# Altium project CT9042.PrjPcb (part 1 of 2)
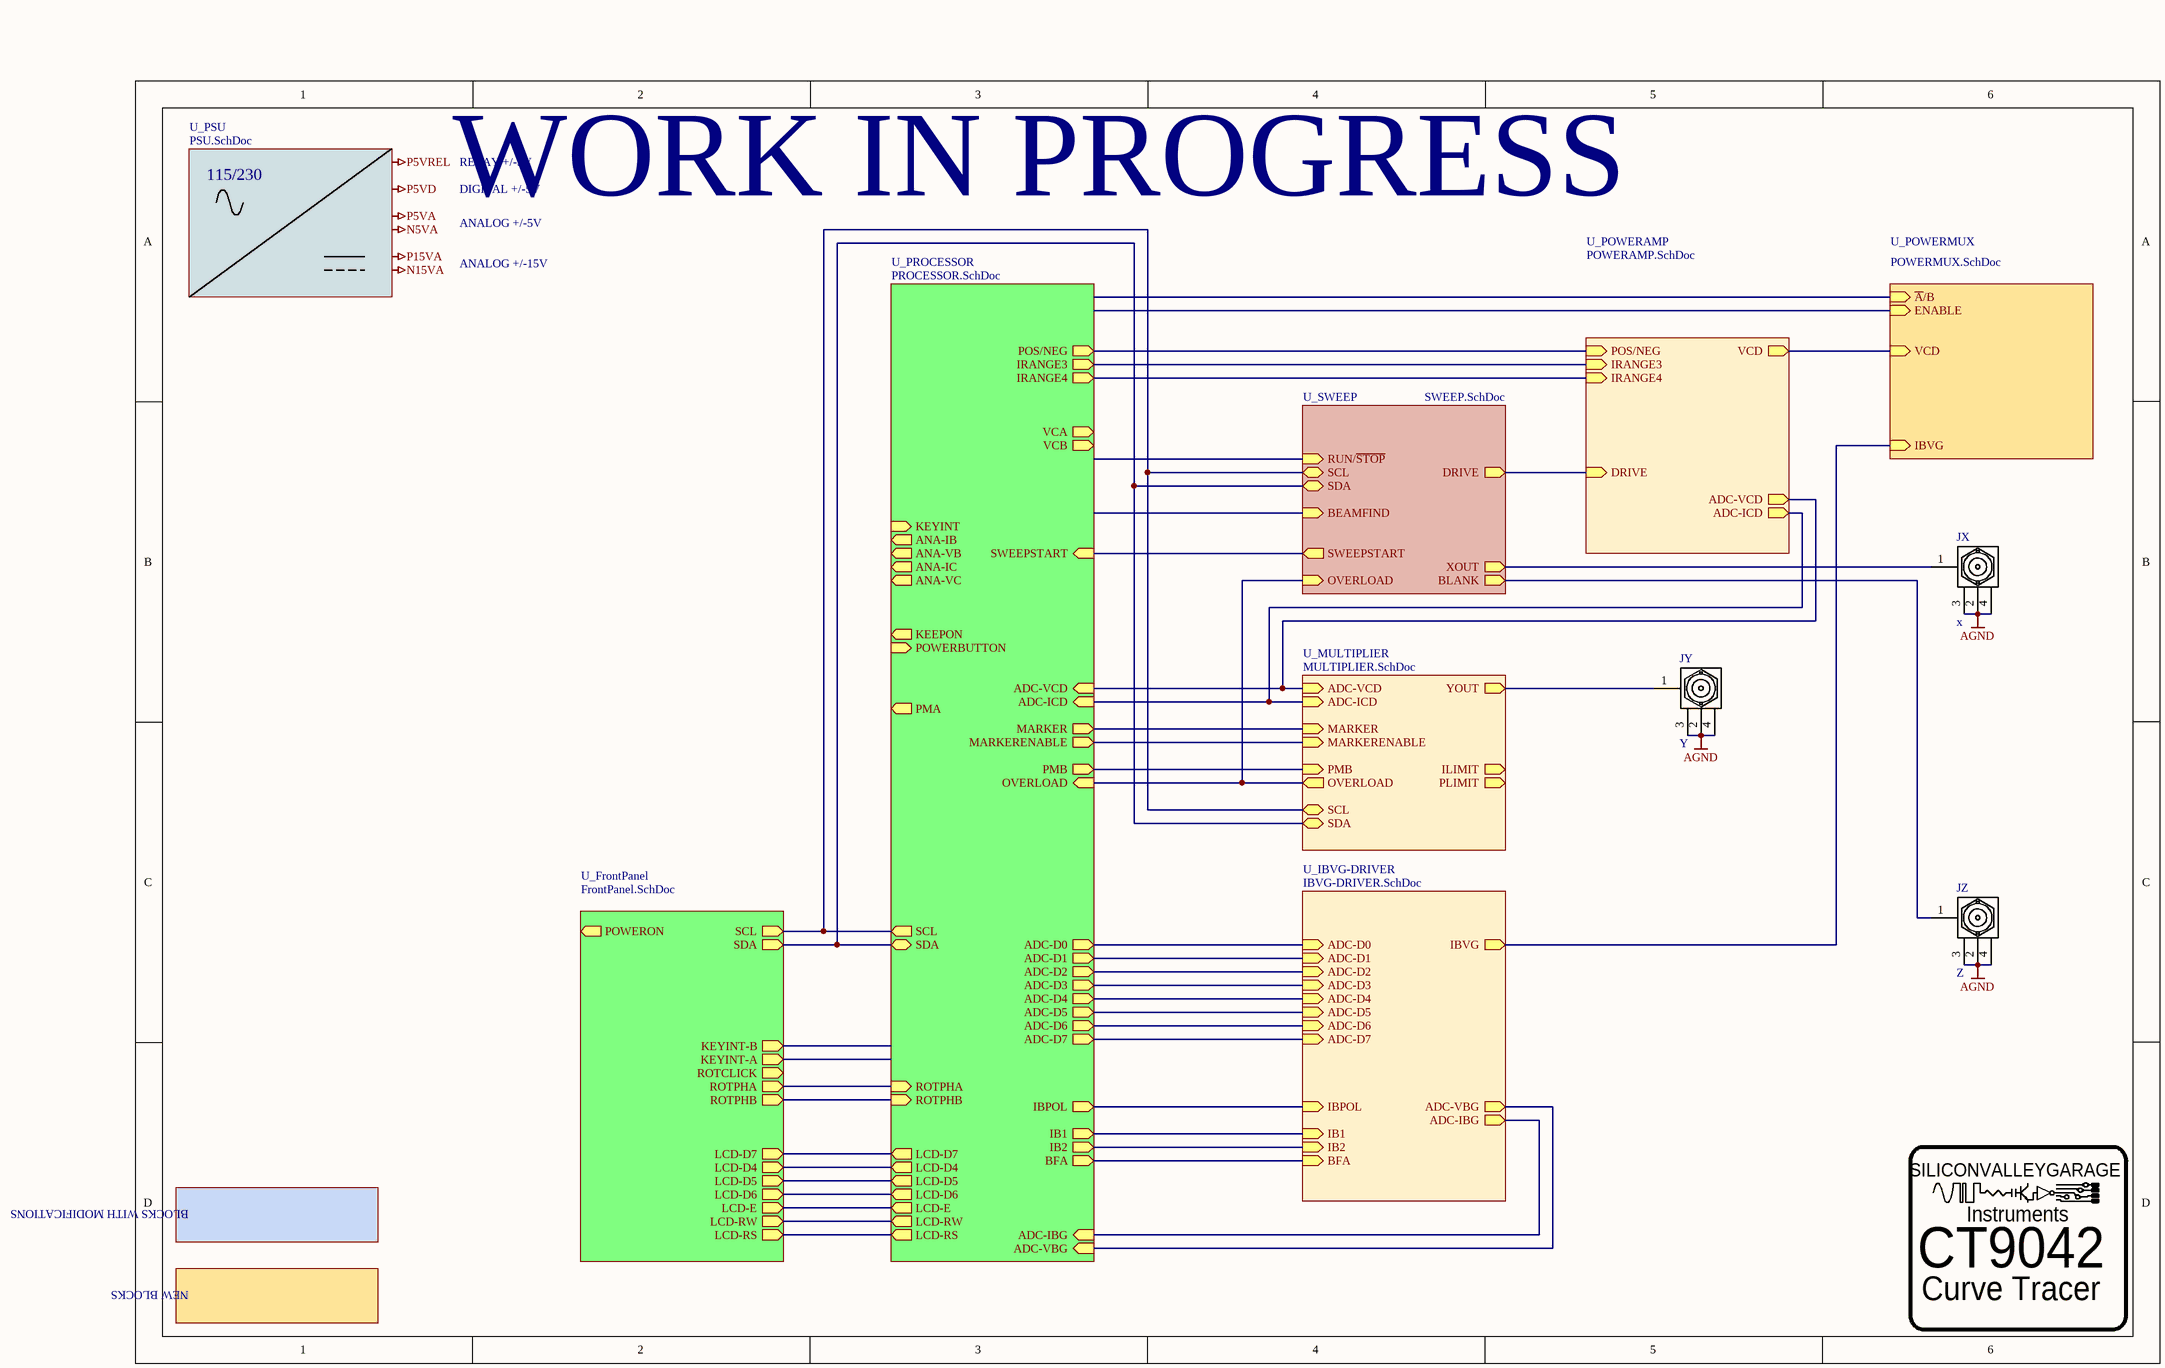
[diagram p0: CT9042 Toplevel.SchDoc]
SCHdrafter: free_electron
9 sheets, 462 parts. Net scope: hierarchical (ports join the sheet entries above them; power ports are global).
Board files: CT9042 Main Board.PcbDoc, CT9042 Front Board.PcbDoc, CT9042 Front Panel.PcbDoc
Sheets:
  CT9042 Toplevel.SchDoc
    U_PSU = PSU.SchDoc
    U_POWERAMP = POWERAMP.SchDoc
    U_IBVG-DRIVER = IBVG-DRIVER.SchDoc
    U_SWEEP = SWEEP.SchDoc
    U_MULTIPLIER = MULTIPLIER.SchDoc
    U_POWERMUX = POWERMUX.SchDoc
    U_FrontPanel = FrontPanel.SchDoc
    U_PROCESSOR = PROCESSOR.SchDoc

## Sheet CT9042 Toplevel.SchDoc
size B; SheetNumber: 1; SheetTotal: 9

### Parts
(Parts that share a designator on the sheet are numbered #1, #2 ... from top to bottom, then left to right.)
JX  x  [CONN-BNC-RA-TE-CONBNC002]
JY  Y  [CONN-BNC-RA-TE-CONBNC002]
JZ  Z  [CONN-BNC-RA-TE-CONBNC002]
LOGO?#1  LOGO-SILICONVALLEYGARAGE-SMALL  [SILICONVALLEYGARAGE]  (value not drawn)  (graphical)

### Blocks framed on the sheet
CT9042: LOGO?#1

### Sub-sheets
U_FrontPanel = FrontPanel.SchDoc: SCL (out), SDA (out), ROTCLICK (out), ROTPHA (out), ROTPHB (out), LCD-D7 (out), LCD-D4 (out), LCD-D5 (out), LCD-D6 (out), LCD-E (out), LCD-RW (out), LCD-RS (out), POWERON (out), KEYINT-B (out), KEYINT-A (out)
U_IBVG-DRIVER = IBVG-DRIVER.SchDoc: BFA (in), IB2 (in), IB1 (in), ADC-D0 (in), ADC-D1 (in), ADC-D2 (in), ADC-D3 (in), ADC-D4 (in), ADC-D5 (in), ADC-D6 (in), ADC-D7 (in), ADC-VBG (out), ADC-IBG (out), IBPOL (in), IBVG (out)
U_MULTIPLIER = MULTIPLIER.SchDoc: PMB (in), OVERLOAD (out), ADC-VCD (in), ADC-ICD (in), MARKER (in), YOUT (out), SCL (bidir), SDA (bidir), MARKERENABLE (in), ILIMIT (out), PLIMIT (out)
U_POWERAMP = POWERAMP.SchDoc: ADC-ICD (out), DRIVE (in), ADC-VCD (out), VCD (out), POS/NEG (in), IRANGE3 (in), IRANGE4 (in)
U_POWERMUX = POWERMUX.SchDoc: VCD (in), IBVG (in), ~{A}/B (in), ENABLE (in)
U_PROCESSOR = PROCESSOR.SchDoc: ADC-D0 (out), ADC-D1 (out), ADC-D2 (out), ADC-D3 (out), ADC-D4 (out), ADC-D5 (out), ADC-D6 (out), ADC-D7 (out), VCA (out), VCB (out), BFA (out), IB2 (out), IB1 (out), IBPOL (out), PMA (out), PMB (out), SCL (out), SDA (bidir), ROTPHA (in), ROTPHB (in), ADC-VBG (in), ADC-IBG (in), ADC-VCD (in), ADC-ICD (in), OVERLOAD (in), LCD-D7 (out), LCD-D4 (out), LCD-D5 (out), LCD-D6 (out), LCD-E (out), LCD-RW (out), LCD-RS (out), KEYINT (in), ANA-IB (out), ANA-VB (out), ANA-IC (out), ANA-VC (out), SWEEPSTART (in), MARKER (out), MARKERENABLE (out), KEEPON (out), POWERBUTTON (in), IRANGE3 (out), IRANGE4 (out), POS/NEG (out)
U_PSU = PSU.SchDoc: no entries
U_SWEEP = SWEEP.SchDoc: DRIVE (out), SWEEPSTART (out), XOUT (out), RUN/~{STOP} (in), SCL (bidir), SDA (bidir), BLANK (out), BEAMFIND (in), OVERLOAD (in)

### Nets
AGND: JX.2 JX.3 JX.4 JY.2 JY.3 JY.4 JZ.2 JZ.3 JZ.4
ADC-D0: sheet U_IBVG-DRIVER/ADC-D0, sheet U_PROCESSOR/ADC-D0
ADC-D1: sheet U_IBVG-DRIVER/ADC-D1, sheet U_PROCESSOR/ADC-D1
ADC-D2: sheet U_IBVG-DRIVER/ADC-D2, sheet U_PROCESSOR/ADC-D2
ADC-D3: sheet U_IBVG-DRIVER/ADC-D3, sheet U_PROCESSOR/ADC-D3
ADC-D4: sheet U_IBVG-DRIVER/ADC-D4, sheet U_PROCESSOR/ADC-D4
ADC-D5: sheet U_IBVG-DRIVER/ADC-D5, sheet U_PROCESSOR/ADC-D5
ADC-D6: sheet U_IBVG-DRIVER/ADC-D6, sheet U_PROCESSOR/ADC-D6
ADC-D7: sheet U_IBVG-DRIVER/ADC-D7, sheet U_PROCESSOR/ADC-D7
ADC-IBG: sheet U_IBVG-DRIVER/ADC-IBG, sheet U_PROCESSOR/ADC-IBG
ADC-ICD: sheet U_POWERAMP/ADC-ICD, sheet U_MULTIPLIER/ADC-ICD, sheet U_PROCESSOR/ADC-ICD
ADC-VBG: sheet U_IBVG-DRIVER/ADC-VBG, sheet U_PROCESSOR/ADC-VBG
ADC-VCD: sheet U_POWERAMP/ADC-VCD, sheet U_MULTIPLIER/ADC-VCD, sheet U_PROCESSOR/ADC-VCD
BFA: sheet U_IBVG-DRIVER/BFA, sheet U_PROCESSOR/BFA
BLANK: JZ.1 ; sheet U_SWEEP/BLANK
DRIVE: sheet U_POWERAMP/DRIVE, sheet U_SWEEP/DRIVE
IB1: sheet U_IBVG-DRIVER/IB1, sheet U_PROCESSOR/IB1
IB2: sheet U_IBVG-DRIVER/IB2, sheet U_PROCESSOR/IB2
IBPOL: sheet U_IBVG-DRIVER/IBPOL, sheet U_PROCESSOR/IBPOL
IBVG: sheet U_IBVG-DRIVER/IBVG, sheet U_POWERMUX/IBVG
IRANGE3: sheet U_POWERAMP/IRANGE3, sheet U_PROCESSOR/IRANGE3
IRANGE4: sheet U_POWERAMP/IRANGE4, sheet U_PROCESSOR/IRANGE4
LCD-D4: sheet U_FrontPanel/LCD-D4, sheet U_PROCESSOR/LCD-D4
LCD-D5: sheet U_FrontPanel/LCD-D5, sheet U_PROCESSOR/LCD-D5
LCD-D6: sheet U_FrontPanel/LCD-D6, sheet U_PROCESSOR/LCD-D6
LCD-D7: sheet U_FrontPanel/LCD-D7, sheet U_PROCESSOR/LCD-D7
LCD-E: sheet U_FrontPanel/LCD-E, sheet U_PROCESSOR/LCD-E
LCD-RS: sheet U_FrontPanel/LCD-RS, sheet U_PROCESSOR/LCD-RS
LCD-RW: sheet U_FrontPanel/LCD-RW, sheet U_PROCESSOR/LCD-RW
MARKER: sheet U_MULTIPLIER/MARKER, sheet U_PROCESSOR/MARKER
MARKERENABLE: sheet U_MULTIPLIER/MARKERENABLE, sheet U_PROCESSOR/MARKERENABLE
OVERLOAD: sheet U_SWEEP/OVERLOAD, sheet U_MULTIPLIER/OVERLOAD, sheet U_PROCESSOR/OVERLOAD
PMB: sheet U_MULTIPLIER/PMB, sheet U_PROCESSOR/PMB
POS/NEG: sheet U_POWERAMP/POS/NEG, sheet U_PROCESSOR/POS/NEG
ROTPHA: sheet U_FrontPanel/ROTPHA, sheet U_PROCESSOR/ROTPHA
ROTPHB: sheet U_FrontPanel/ROTPHB, sheet U_PROCESSOR/ROTPHB
SCL: sheet U_SWEEP/SCL, sheet U_MULTIPLIER/SCL, sheet U_FrontPanel/SCL, sheet U_PROCESSOR/SCL
SDA: sheet U_SWEEP/SDA, sheet U_MULTIPLIER/SDA, sheet U_FrontPanel/SDA, sheet U_PROCESSOR/SDA
SWEEPSTART: sheet U_SWEEP/SWEEPSTART, sheet U_PROCESSOR/SWEEPSTART
VCD: sheet U_POWERAMP/VCD, sheet U_POWERMUX/VCD
XOUT: JX.1 ; sheet U_SWEEP/XOUT
YOUT: JY.1 ; sheet U_MULTIPLIER/YOUT

### Notes on the sheet
- 115/230
- RELAY +/-5V
- WORK IN PROGRESS
- ANALOG +/-5V
- DIGITAL +/-5V
- ANALOG +/-15V
- BLOCKS WITH MODIFICATIONS
- (near LOGO?#1) Instruments
- NEW BLOCKS
- Curve Tracer
- Labels drawn without touching a wire or pin: N5VA, N15VA, P5VA, P5VD, P5VREL, P15VA
- (in symbol LOGO-SILICONVALLEYGARAGE-SMALL) SILICONVALLEYGARAGE

### Library data of the parts
JX JY JZ = CONN-BNC-RA-TE-CONBNC002
LOGO?#1 = LOGO-SILICONVALLEYGARAGE-SMALL: LOGO,SILICONVALLEYGARAGE,SMALL

## Sheet PSU.SchDoc
size Tabloid; SheetNumber: 9; SheetTotal: 9
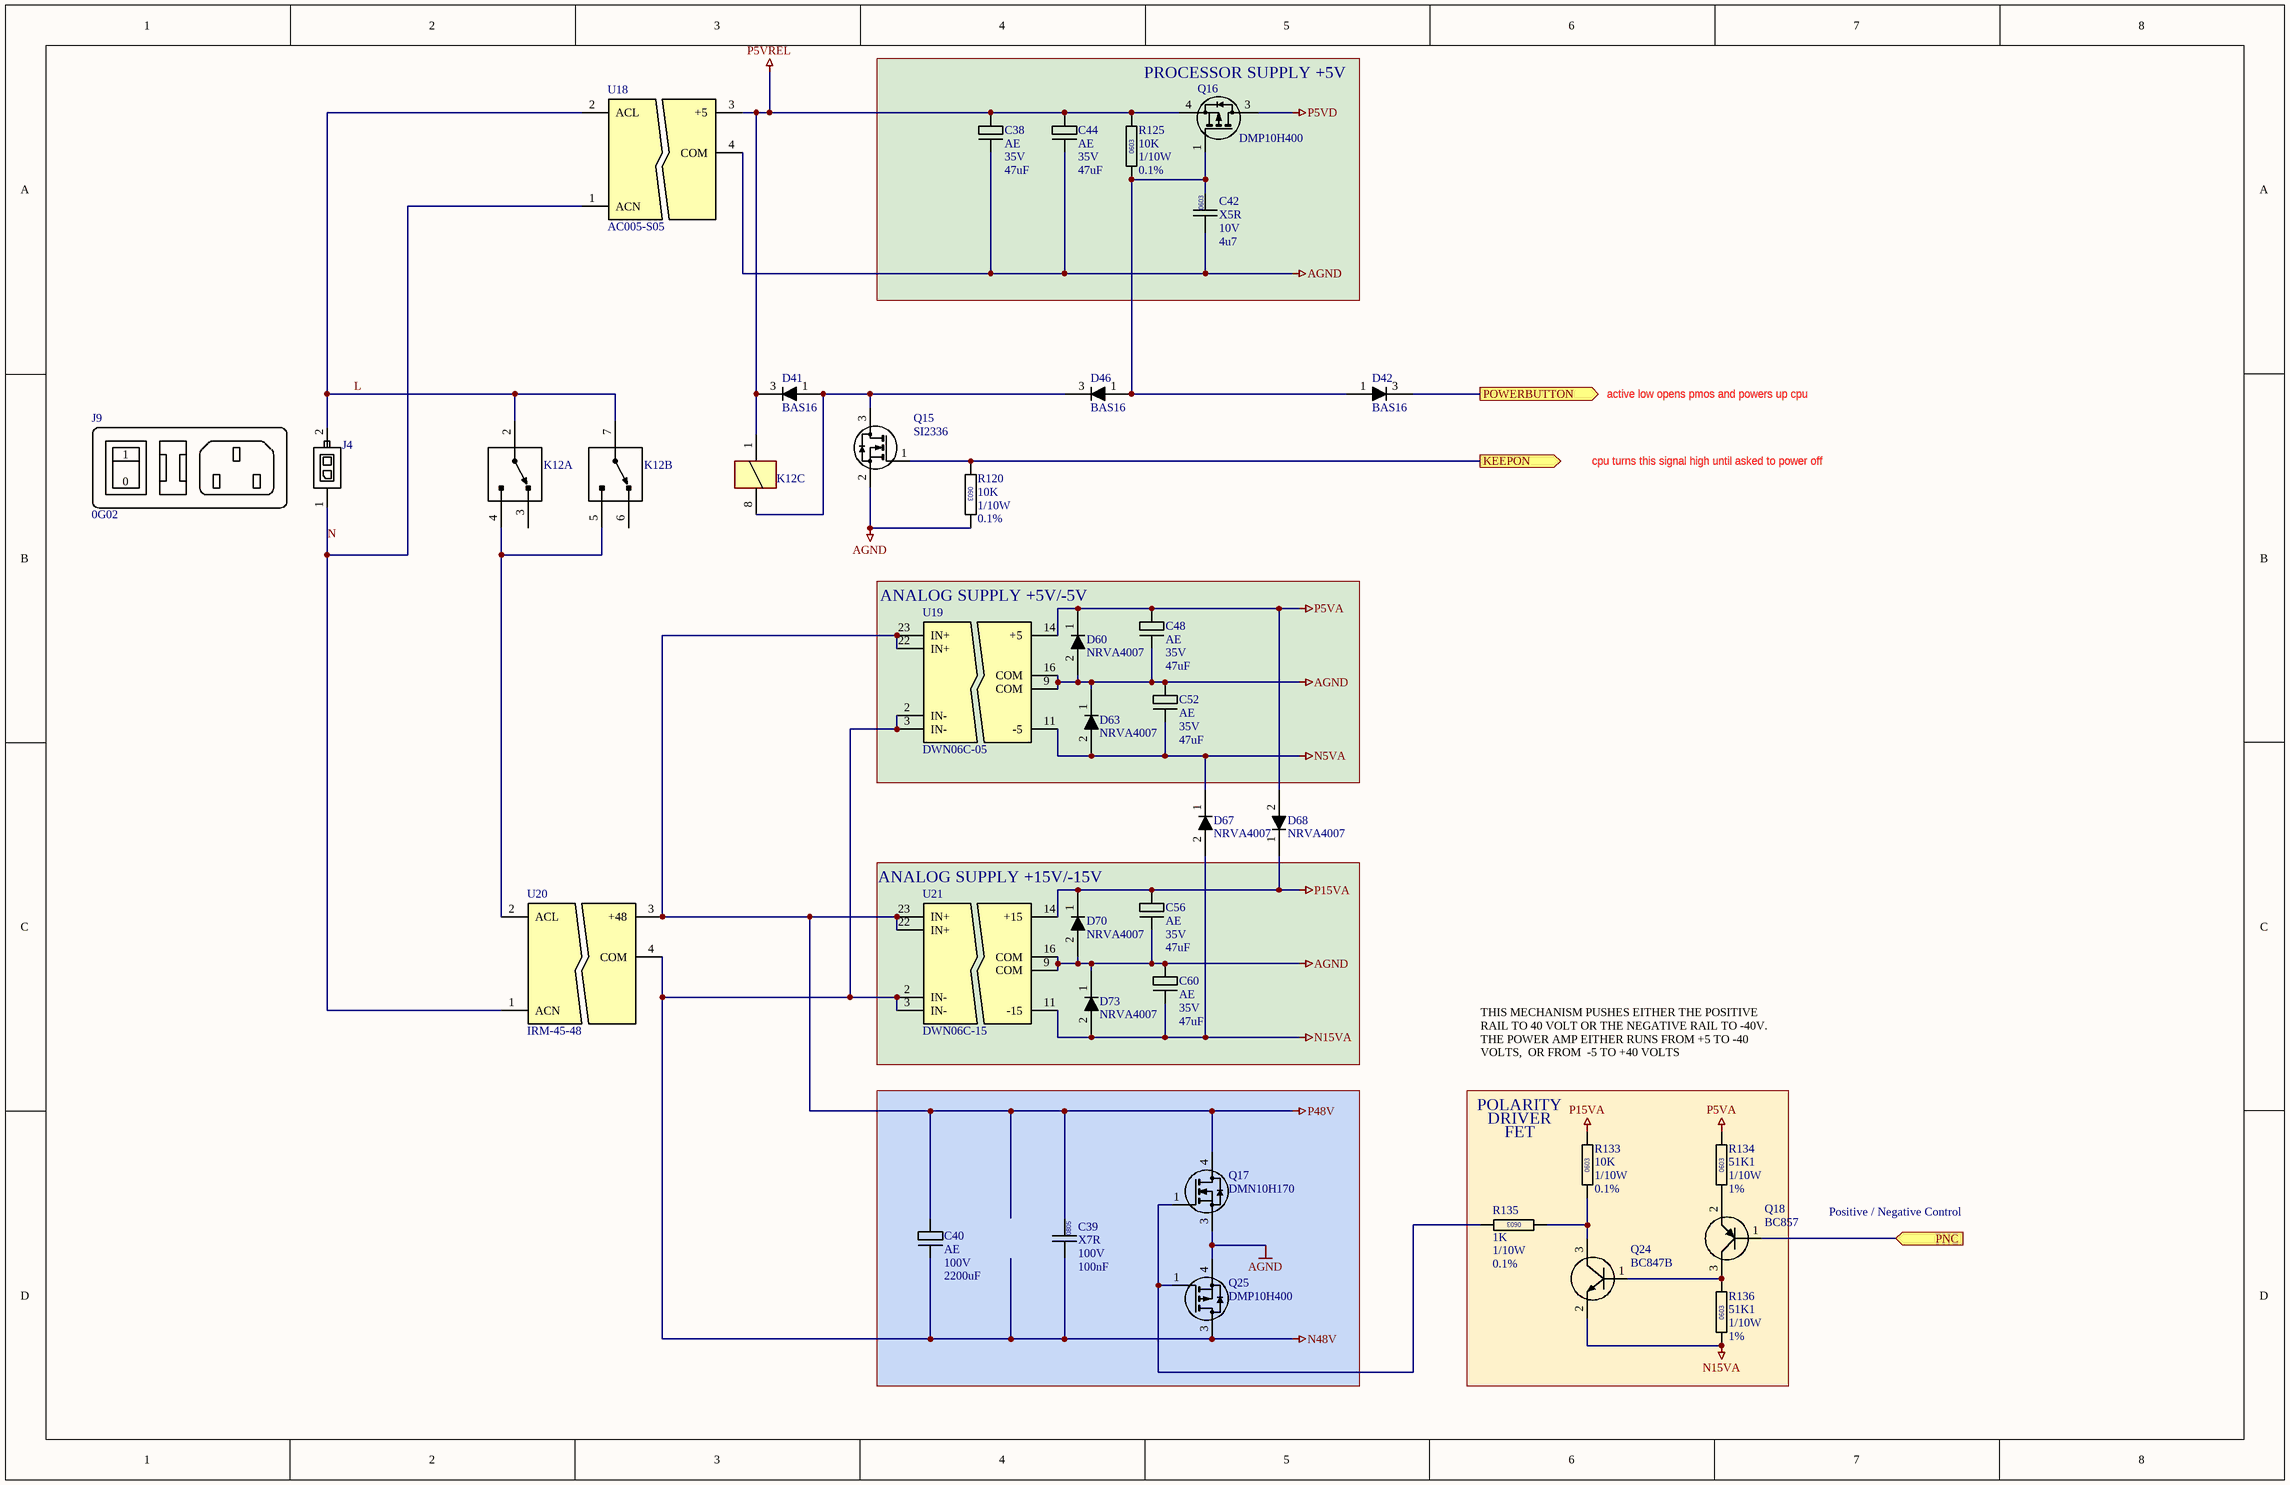
[diagram p1: PSU.SchDoc]

### Parts
C38  Dielectric: AE  Voltage: 35V  Capacitance: 47uF  [CAPAE-KEMET-ESW476M035AE3AA]  (hidden comment: CAP0603)
C39  Dielectric: X7R  Voltage: 100V  Capacitance: 100nF  [CAPC0805]  (hidden comment: CAP0805)
C40  Dielectric: AE  Voltage: 100V  Capacitance: 2200uF  [CAPAE-NICHICON-LGY2A222MELC30]  (hidden comment: CAP0603)
C42  Dielectric: X5R  Voltage: 10V  Capacitance: 4u7  [CAPC0603]  (hidden comment: CAP0603)
C44  Dielectric: AE  Voltage: 35V  Capacitance: 47uF  [CAPAE-KEMET-ESW476M035AE3AA]  (hidden comment: CAP0603)
C48  Dielectric: AE  Voltage: 35V  Capacitance: 47uF  [CAPAE-KEMET-ESW476M035AE3AA]  (hidden comment: CAP0603)
C52  Dielectric: AE  Voltage: 35V  Capacitance: 47uF  [CAPAE-KEMET-ESW476M035AE3AA]  (hidden comment: CAP0603)
C56  Dielectric: AE  Voltage: 35V  Capacitance: 47uF  [CAPAE-KEMET-ESW476M035AE3AA]  (hidden comment: CAP0603)
C60  Dielectric: AE  Voltage: 35V  Capacitance: 47uF  [CAPAE-KEMET-ESW476M035AE3AA]  (hidden comment: CAP0603)
D41  BAS16  [SOT23]
D42  BAS16  [SOT23]
D46  BAS16  [SOT23]
D60  NRVA4007  [DO214AC]
D63  NRVA4007  [DO214AC]
D67  NRVA4007  [DO214AC]
D68  NRVA4007  [DO214AC]
D70  NRVA4007  [DO214AC]
D73  NRVA4007  [DO214AC]
J4  CONNECTOR-MOLEX-43045-0202  [CONN-MOLEX-430450214]  (value not drawn)
J9  0G02  (mechanical)
K12  RELAY-CIT-J104B2C5VDC.20S  [RELAY-CIT-J104B2C5VDC.20S]  (value not drawn)  (parts A,B,C of 3)
Q15  SI2336  [SOT23]
Q16  DMP10H400  [DPAK]
Q17  DMN10H170  [DPAK]
Q18  BC857  [SOT23]
Q24  BC847B  [SOT23]
Q25  DMP10H400  [DPAK]
R120  value 10K  Power: 1/10W  Tolerance: 0.1%  [RESC0603]  (hidden comment: RESC0603)
R125  value 10K  Power: 1/10W  Tolerance: 0.1%  [RESC0603]  (hidden comment: RESC0603)
R133  value 10K  Power: 1/10W  Tolerance: 0.1%  [RESC0603]  (hidden comment: RESC0603)
R134  value 51K1  Power: 1/10W  Tolerance: 1%  [RESC0603]  (hidden comment: RESC0603)
R135  value 1K  Power: 1/10W  Tolerance: 0.1%  [RESC0603]  (hidden comment: RESC0603)
R136  value 51K1  Power: 1/10W  Tolerance: 1%  [RESC0603]  (hidden comment: RESC0603)
U18  AC005-S05  [MODULE-ADAMTECH-AC005-S05]
U19  DWN06C-05  [MODULE-MEANWELL-DCWN06C]
U20  IRM-45-48  [MODULE-MEANWELL-IRM-45-48]
U21  DWN06C-15  [MODULE-MEANWELL-DCWN06C]

### Blocks framed on the sheet
PROCESSOR SUPPLY +5V: C38 C42 C44 Q16 R125
ANALOG SUPPLY +5V/-5V: C48 C52 D60 D63 U19
ANALOG SUPPLY +15V/-15V: C56 C60 D70 D73 U21

### Ports
KEEPON (out), PNC (in), POWERBUTTON (out)

### Nets
AGND: C38.2 C42.2 C44.2 C48.2 C52.1 C56.2 C60.1 D60.2(A) D63.1(K) D70.2(A) D73.1(K) Q15.2(S) Q17.3(S) Q25.4(S) R120.1 U18.4(COM) U19.9(COM) U19.16(COM) U21.9(COM) U21.16(COM)
N5VA: C52.2 D63.2(A) D67.1(K) U19.11(-5)
N15VA: C60.2 D67.2(A) D73.2(A) Q24.2(E) R136.2 U21.11(-15)
N48V: C39.2 C40.2 Q25.3(D) U19.2(IN-) U19.3(IN-) U20.4(COM) U21.2(IN-) U21.3(IN-)
P5VA: C48.1 D60.1(K) D68.2(A) R134.1 U19.14(+5)
P5VD: Q16.3(D)
P5VREL: C38.1 C44.1 D41.3(K) K12.1 Q16.4(S) R125.1 U18.3(+5)
P15VA: C56.1 D68.1(K) D70.1(K) R133.1 U21.14(+15)
P48V: C39.1 C40.1 Q17.4(D) U19.22(IN+) U19.23(IN+) U20.3(+48) U21.22(IN+) U21.23(IN+)
KEEPON: Q15.1(G1) R120.2 ; port KEEPON
L: J4.2 K12.2(NC) K12.7(NC) U18.2(ACL)
N: J4.1 U18.1(ACN) U20.1(ACN)
PNC: Q18.1(B) ; port PNC
POWERBUTTON: D42.3(K) ; port POWERBUTTON
NetC42_1: C42.1 D42.1(A) D46.1(A) Q16.1(G1) R125.2
NetD41_1: D41.1(A) D46.3(K) K12.8 Q15.3(D)
NetK12_4: K12.4(NO) K12.5(NO) U20.2(ACL)
NetQ17_1: Q17.1(G1) Q25.1(G1) R135.2
NetQ18_2: Q18.2(E) R134.2
NetQ18_3: Q18.3(C) Q24.1(B) R136.1
NetQ24_3: Q24.3(C) R133.2 R135.1

Not connected (* = marked no-connect by the designer): K12 3(COM) 6(COM)

### Notes on the sheet
- active low opens pmos and powers up cpu
- cpu turns this signal high until asked to power off
- THIS MECHANISM PUSHES EITHER THE POSITIVE RAIL TO 40 VOLT OR THE NEGATIVE RAIL TO -40V.
  THE POWER AMP EITHER RUNS FROM +5 TO -40 VOLTS,  OR FROM  -5 TO +40 VOLTS
- (near R133) POLARITY
- (near R133) DRIVER
- FET
- Positive / Negative Control
- (in symbol CAPC-0805-100nF-100V) 0805
- (in symbol CONN-DELTA-0G02) 1; 0
- (in symbol RESC-0603-1K-0.1%-1/10W) 0603
- (in symbol RESC-0603-10K-0.1%-1/10W) 0603
- (in symbol RESC-0603-51K1-1%-1/10W) 0603

### Library data of the parts
C38 C44 C48 C52 C56 C60 = CAPP-AE-47uF-35V-TH025P063D125H: CAPACITOR,ALU,47uF,35V,TH,P0.25mm,D6.3mm,H12.5mm; Manufacturer 1: KEMET; Manufacturer Part Number 1: ESW476M035AE3AA; Location: *
C39 = CAPC-0805-100nF-100V: CAPACITOR,CERAMIC,100nF,100V,X7R,0805; Package / Case: 0805 (2012 metric); Location: *
C40 = CAPP-AE-2200uF-100V-TH100P350D320H: CAPACITOR,ALU,2200uF,100V,TH,P10mm,D35mm,H32mm,SNAP; Manufacturer 1: NICHICON; Manufacturer Part Number 1: LGY2A222MELC30; Location: *
C42 = CAPC-0603-4u7-10V-X5R: CAPACITOR,CERAMIC,4u7,10V,X5R,0603; Manufacturer 1: SAMSUNG; Manufacturer Part Number 1: CL10A475KP8NNNC; Package / Case: 0603; Location: *; Supplier 1: Arrow Electronics; Supplier Part Number 1: GRM188Z71A475KE15J; LCSC: C1705; MOUSER: 187-CL10A475KP8NNNC
D41 D42 D46 = DIODE-RECTIFIER-DIODES-BAS16-SOT23: DIODE,RECTIFIER,75V,0.3A,BAS16,SOT23; Manufacturer 1: ONSEMI; Manufacturer Part Number 1: BAS16LT1G; DIGIKEY: BAS16LT1GOSCT-ND
D60 D63 D67 D68 D70 D73 = DIODE-ONSEMI-NRVA4007T3G: DIODE,RECTIFIER,1000V,1A,ONSEMI,NRVA4007,SMA; DIGIKEY: NRVA4007T3GOSCT-ND; Manufacturer 1: ONSEMI; Manufacturer Part Number 1: NRVA4007T3G
J4 = CONN-MOLEX-430450214: CONN,1X2,MOLEX, MICROFIT,VERT
J9 = CONN-DELTA-0G02: CONN,POWER,IEC,SWITCH,FUSE ASSEMBLY,PANELMOUNT
K12 = RELAY-CIT-J104B2C5VDC.20S: RELAY,DPDT,5V COIL,250VAC,3A; Manufacturer 1: CIT; DIGIKEY: 2449-J104B2C5VDC.20S-ND; Manufacturer Part Number 1: J104B2C5VDC.20S
Q15 = XSTR-NMOS-VISHAY-SI2336DS-T1-BE3: XSTR,NMOS,30V,4.3A,SI2336DS-T1-BE3.SOT23; Manufacturer 1: VISHAY; Package: SOT23; Vds: 30V; Idmax: 4.3A; DIGIKEY: 742-SI2336DS-T1-BE3CT-ND; Manufacturer Part Number 1: SI2336DS-T1-BE3
Q16 Q25 = XSTR-PMOS-DIODES-DMP10H400SK3-13: XSTR,PMOS,100V,5.6A,DMP10H400SK3-13,DPAK; Manufacturer 1: DIODES; Idmax: 9A; Package: DPAK; Vds: 100V; Manufacturer Part Number 1: DMP10H400SK3-13
Q17 = XSTR-NMOS-DIODES-DMN10H170SK3-13: XSTR,NMOS,100V,12A,DMN10H170SK3-13,DPAK; Manufacturer 1: DIODES; Idmax: 5.6; Package: DPAK; Vds: 100V; Manufacturer Part Number 1: DMN10H170SK3-13
Q18 = XSTR-PNP-BC857: XSTR,PNP,SOT23,BC857,SOT23
Q24 = XSTR-NPN-BC847: XSTR,NPN,45V,0.1A,,BC847B,SOT23
R120 R125 R133 = RESC-0603-10K-0.1%-1/10W: RESISTOR,10K,0.1%,100mW,0603 (1608); Location: *
R134 R136 = RESC-0603-51K1-1%-1/10W: RESISTOR,51K1,1%,100mW,0603 (1608); Location: *
R135 = RESC-0603-1K-0.1%-1/10W: RESISTOR,1K,0.1%,100mW,0603 (1608); Location: *
U18 = MODULE-ADAMTECH-AC005-S05: MOD,AC/DC,ISO,90...264 AC,+5V OUT,1A
U19 = MODULE-MEANWELL-DWN06C-05: MOD,DC/DC,ISO,DC 36...72V IN,+/-5V OUT,1A
U20 = MODULE-MEANWELL-IRM-45-48: MOD,AC/DC,ISO,90...264 AC,+48V OUT,1A
U21 = MODULE-MEANWELL-DWN06C-15: MOD,DC/DC,ISO,DC 36...72V IN,+/-15V OUT,200mA

## Sheet POWERAMP.SchDoc
size Tabloid; SheetNumber: 6; SheetTotal: 9
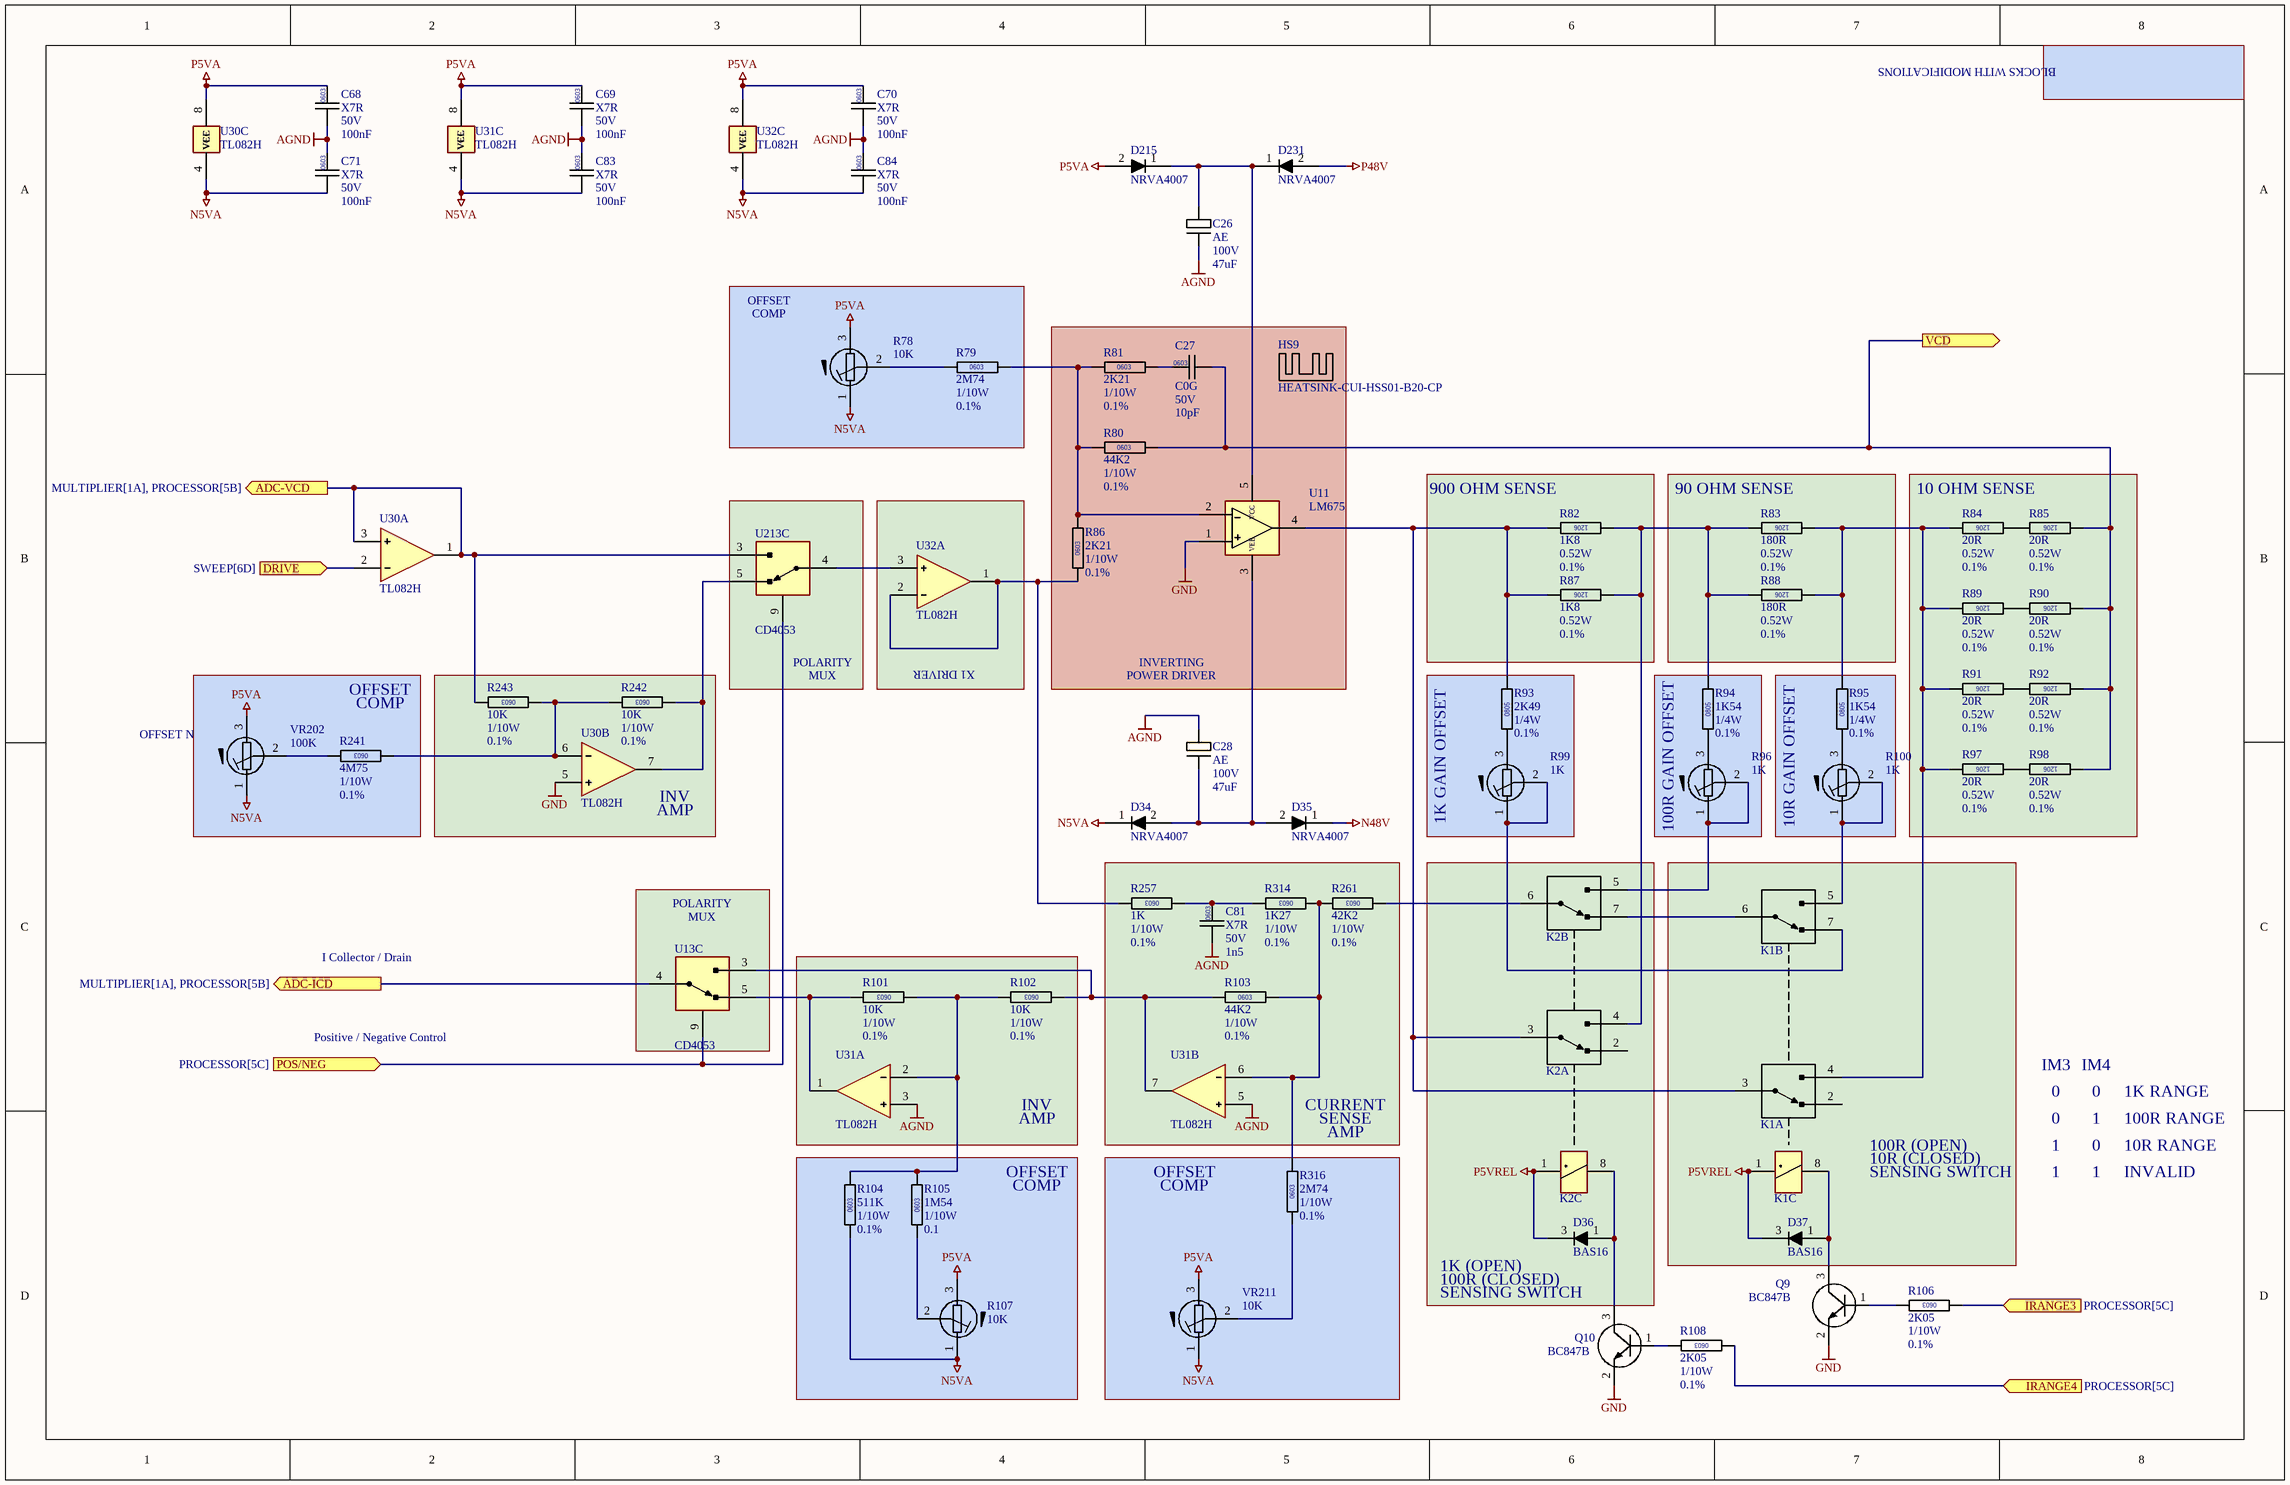
[diagram p2: POWERAMP.SchDoc]

### Parts
C26  Dielectric: AE  Voltage: 100V  Capacitance: 47uF  [CAPAE-KEMET-ESL476M100AH9AA]  (hidden comment: CAP0603)
C27  Dielectric: C0G  Voltage: 50V  Capacitance: 10pF  [CAPC0603]  (hidden comment: CAP0603)
C28  Dielectric: AE  Voltage: 100V  Capacitance: 47uF  [CAPAE-KEMET-ESL476M100AH9AA]  (hidden comment: CAP0603)
C68  Dielectric: X7R  Voltage: 50V  Capacitance: 100nF  [CAPC0603]  (hidden comment: CAP0603)
C69  Dielectric: X7R  Voltage: 50V  Capacitance: 100nF  [CAPC0603]  (hidden comment: CAP0603)
C70  Dielectric: X7R  Voltage: 50V  Capacitance: 100nF  [CAPC0603]  (hidden comment: CAP0603)
C71  Dielectric: X7R  Voltage: 50V  Capacitance: 100nF  [CAPC0603]  (hidden comment: CAP0603)
C81  Dielectric: X7R  Voltage: 50V  Capacitance: 1n5  [CAPC0603]  (hidden comment: CAP0603)
C83  Dielectric: X7R  Voltage: 50V  Capacitance: 100nF  [CAPC0603]  (hidden comment: CAP0603)
C84  Dielectric: X7R  Voltage: 50V  Capacitance: 100nF  [CAPC0603]  (hidden comment: CAP0603)
D34  NRVA4007  [DO214AC]
D35  NRVA4007  [DO214AC]
D36  BAS16  [SOT23]
D37  BAS16  [SOT23]
D215  NRVA4007  [DO214AC]
D231  NRVA4007  [DO214AC]
HS9  HEATSINK-CUI-HSS01-B20-CP  [HEATSINK-CUI-HSS01-B20-CP]
K1  RELAY-KEMET-UA2-5NJ  [RELAY-KEMET-UA2-5NJ]  (value not drawn)  (parts A,B,C of 3)
K2  RELAY-KEMET-UA2-5NJ  [RELAY-KEMET-UA2-5NJ]  (value not drawn)  (parts A,B,C of 3)
Q9  BC847B  [SOT23]
Q10  BC847B  [SOT23]
R78  value 10K  [TRIMMER-BOURNS-3214X]  (hidden comment: TRIMMER-BOURNS-3214X-1-103E)
R79  value 2M74  Power: 1/10W  Tolerance: 0.1%  [RESC0603]  (hidden comment: RESC0603)
R80  value 44K2  Power: 1/10W  Tolerance: 0.1%  [RESC0603]  (hidden comment: RESC0603)
R81  value 2K21  Power: 1/10W  Tolerance: 0.1%  [RESC0603]  (hidden comment: RESC0603)
R82  value 1K8  Power: 0.52W  Tolerance: 0.1%  [RESC1206]  (hidden comment: RESC1206)
R83  value 180R  Power: 0.52W  Tolerance: 0.1%  [RESC1206]  (hidden comment: RESC1206)
R84  value 20R  Power: 0.52W  Tolerance: 0.1%  [RESC1206]  (hidden comment: RESC1206)
R85  value 20R  Power: 0.52W  Tolerance: 0.1%  [RESC1206]  (hidden comment: RESC1206)
R86  value 2K21  Power: 1/10W  Tolerance: 0.1%  [RESC0603]  (hidden comment: RESC0603)
R87  value 1K8  Power: 0.52W  Tolerance: 0.1%  [RESC1206]  (hidden comment: RESC1206)
R88  value 180R  Power: 0.52W  Tolerance: 0.1%  [RESC1206]  (hidden comment: RESC1206)
R89  value 20R  Power: 0.52W  Tolerance: 0.1%  [RESC1206]  (hidden comment: RESC1206)
R90  value 20R  Power: 0.52W  Tolerance: 0.1%  [RESC1206]  (hidden comment: RESC1206)
R91  value 20R  Power: 0.52W  Tolerance: 0.1%  [RESC1206]  (hidden comment: RESC1206)
R92  value 20R  Power: 0.52W  Tolerance: 0.1%  [RESC1206]  (hidden comment: RESC1206)
R93  value 2K49  Power: 1/4W  Tolerance: 0.1%  [RESC0805]  (hidden comment: RESC0805)
R94  value 1K54  Power: 1/4W  Tolerance: 0.1%  [RESC0805]  (hidden comment: RESC0805)
R95  value 1K54  Power: 1/4W  Tolerance: 0.1%  [RESC0805]  (hidden comment: RESC0805)
R96  value 1K  [TRIMMER-BOURNS-3214X]  (hidden comment: TRIMMER-BOURNS-3214X-1-102E)
R97  value 20R  Power: 0.52W  Tolerance: 0.1%  [RESC1206]  (hidden comment: RESC1206)
R98  value 20R  Power: 0.52W  Tolerance: 0.1%  [RESC1206]  (hidden comment: RESC1206)
R99  value 1K  [TRIMMER-BOURNS-3214X]  (hidden comment: TRIMMER-BOURNS-3214X-1-102E)
R100  value 1K  [TRIMMER-BOURNS-3214X]  (hidden comment: TRIMMER-BOURNS-3214X-1-102E)
R101  value 10K  Power: 1/10W  Tolerance: 0.1%  [RESC0603]  (hidden comment: RESC0603)
R102  value 10K  Power: 1/10W  Tolerance: 0.1%  [RESC0603]  (hidden comment: RESC0603)
R103  value 44K2  Power: 1/10W  Tolerance: 0.1%  [RESC0603]  (hidden comment: RESC0603)
R104  value 511K  Power: 1/10W  Tolerance: 0.1%  [RESC0603]  (hidden comment: RESC0603)
R105  value 1M54  Power: 1/10W  Tolerance: 0.1  [RESC0603]  (hidden comment: RESC0603)
R106  value 2K05  Power: 1/10W  Tolerance: 0.1%  [RESC0603]  (hidden comment: RESC0603)
R107  value 10K  [TRIMMER-BOURNS-3214X]  (hidden comment: TRIMMER-BOURNS-3214X-1-103E)
R108  value 2K05  Power: 1/10W  Tolerance: 0.1%  [RESC0603]  (hidden comment: RESC0603)
R241  value 4M75  Power: 1/10W  Tolerance: 0.1%  [RESC0603]  (hidden comment: RESC0603)
R242  value 10K  Power: 1/10W  Tolerance: 0.1%  [RESC0603]  (hidden comment: RESC0603)
R243  value 10K  Power: 1/10W  Tolerance: 0.1%  [RESC0603]  (hidden comment: RESC0603)
R257  value 1K  Power: 1/10W  Tolerance: 0.1%  [RESC0603]  (hidden comment: RESC0603)
R261  value 42K2  Power: 1/10W  Tolerance: 0.1%  [RESC0603]  (hidden comment: RESC0603)
R314  value 1K27  Power: 1/10W  Tolerance: 0.1%  [RESC0603]  (hidden comment: RESC0603)
R316  value 2M74  Power: 1/10W  Tolerance: 0.1%  [RESC0603]  (hidden comment: RESC0603)
U11  LM675  [TO220-5-V]
U13  CD4053  [SO127P600-16N]  (part C of 4)
U30  TL082H  [SO127P600-8N]  (parts A,B,C of 3)
U31  TL082H  [SO127P600-8N]  (parts A,B,C of 3)
U32  TL082H  [SO127P600-8N]  (parts A,C of 3)
U213  CD4053  [SO127P600-16N]  (part C of 4)
VR202  value 100K  [TRIMMER-BOURNS-3214X]  (hidden comment: TRIMMER-BOURNS-3214X-1-104)
VR211  value 10K  [TRIMMER-BOURNS-3214X]  (hidden comment: TRIMMER-BOURNS-3214X-1-103E)

### Blocks framed on the sheet
900 OHM SENSE: R82 R87
90 OHM SENSE: R83 R88
10 OHM SENSE: R84 R85 R89-R92 R97 R98
X1 DRIVER: U32
1K GAIN OFFSET: R93 R99
100R GAIN OFFSET: R94 R96
10R GAIN OFFSET: R95 R100

### Ports
ADC-ICD (out, see MULTIPLIER[1A], PROCESSOR[5B]), ADC-VCD (out, see MULTIPLIER[1A], PROCESSOR[5B]), DRIVE (in, see SWEEP[6D]), IRANGE3 (in, see PROCESSOR[5C]), IRANGE4 (in, see PROCESSOR[5C]), POS/NEG (in, see PROCESSOR[5C]), VCD (out)

### Nets
AGND: C26.2 C28.1 C68.2 C69.2 C70.2 C71.1 C81.2 C83.1 C84.1 U31.3(+) U31.5(+)
GND: Q9.2(E) Q10.2(E) U11.1(+) U30.5(+)
N5VA: C71.2 C83.2 C84.2 D34.1(K) R78.1 R104.2 R107.1 U30.4(VEE) U31.4(VEE) U32.4(VEE) VR202.1 VR211.1
N48V: D35.1(K)
P5VA: C68.1 C69.1 C70.1 D215.2(A) R78.3 R107.3 U30.8(VCC) U31.8(VCC) U32.8(VCC) VR202.3 VR211.3
P5VREL: D36.3(K) D37.3(K) K1.1 K2.1
P48V: D231.2(A)
ADC-ICD: U13.4(Y3) ; port ADC-ICD
ADC-VCD: R243.1 U30.1(O) U30.3(+) U213.3(Y) ; port ADC-VCD
DRIVE: U30.2(-) ; port DRIVE
IRANGE3: R106.1 ; port IRANGE3
IRANGE4: R108.1 ; port IRANGE4
POS/NEG: U13.9(B) U213.9(B) ; port POS/NEG
VCD: C27.2 R80.2 R85.2 R90.2 R92.2 R98.2 ; port VCD
NetC26_1: C26.1 D215.1(K) D231.1(K) U11.5(VCC)
NetC27_1: C27.1 R81.2
NetC28_2: C28.2 D34.2(A) D35.2(A) U11.3(VEE)
NetC81_1: C81.1 R257.2 R314.1
NetD36_1: D36.1(A) K2.8 Q10.3(C)
NetD37_1: D37.1(A) K1.8 Q9.3(C)
NetK1_3: K1.3(COM) K2.3(COM) R82.1 R87.1 R93.1 U11.4(OUT)
NetK1_4: K1.4(NO) R83.2 R84.1 R88.2 R89.1 R91.1 R95.2 R97.1
NetK1_5: K1.5(NO) R100.1 R100.2
NetK1_6: K1.6(COM) K2.7(NC)
NetK1_7: K1.7(NC) R99.1 R99.2
NetK2_4: K2.4(NO) R82.2 R83.1 R87.2 R88.1 R94.2
NetK2_5: K2.5(NO) R96.1 R96.2
NetK2_6: K2.6(COM) R261.2
NetQ9_1: Q9.1(B) R106.2
NetQ10_1: Q10.1(B) R108.2
NetR78_2: R78.2 R79.1
NetR79_2: R79.2 R80.1 R81.1 R86.2 U11.2(-)
NetR84_2: R84.2 R85.1
NetR86_1: R86.1 R257.1 U32.1(O) U32.2(-)
NetR89_2: R89.2 R90.1
NetR91_2: R91.2 R92.1
NetR93_2: R93.2 R99.3
NetR94_1: R94.1 R96.3
NetR95_1: R95.1 R100.3
NetR97_2: R97.2 R98.1
NetR101_1: R101.1 U13.5(Y1) U31.1(O)
NetR101_2: R101.2 R102.1 R104.1 R105.1 U31.2(-)
NetR102_2: R102.2 R103.1 U13.3(Y) U31.7(O)
NetR103_2: R103.2 R261.1 R314.2 R316.2 U31.6(-)
NetR105_2: R105.2 R107.2
NetR241_1: R241.1 VR202.2
NetR241_2: R241.2 R242.1 R243.2 U30.6(-)
NetR242_2: R242.2 U30.7(O) U213.5(Y1)
NetR316_1: R316.1 VR211.2
NetU32_3: U32.3(+) U213.4(Y3)

Not connected (* = marked no-connect by the designer): K1 2(NC); K2 2(NC)

### Notes on the sheet
- BLOCKS WITH MODIFICATIONS
- OFFSET
- COMP
- (near R241) COMP
- POLARITY
- MUX
- POWER DRIVER
- INVERTING
- OFFSET N
- (near U30) INV
- (near U30) AMP
- I Collector / Drain
- (near U13) MUX
- Positive / Negative Control
- INV
- CURRENT
- IM3
- 0
- IM4
- 1K RANGE
- AMP
- SENSE
- (near R316) AMP
- 100R (OPEN)
- SENSING SWITCH
- 10R (CLOSED)
- 1
- INVALID
- 100R RANGE
- 10R RANGE
- 1K (OPEN)
- (near D36) 100R (CLOSED)
- DWG. NO.
- REV.
- SHT.
- THIS DOCUMENT AND THE DATA DISCLOSED HEREIN OR HEREWITH IS THE PROPERTY OF ALTIUM LIMITED AND MAY BE FREELY DISTRIBUTED IN WHOLE. NO RIGHTS ARE RESERVED OR EXPRESS OR IMPLIED WARANTEE GIVEN.
- REVISION
- DESCRIPTION
- DATE
- APPROVED
- ENG:
- APPROVALS
- PROJECT
- DSN:
- CHK:
- REFERENCE DOCUMENTS
- PROJECT REVISION:
- TITLE
- DOCUMENT REVISION:
- DESIGN ITEM:
- BOM:
- FAB DWG:
- PCB DWG:
- ASSY DWG:
- SCALE:
- SIZE
- B
- CAGE CODE
- FILE NAME
- DWG NO.
- SHEET
- OF
- REV
- (in symbol RESC-0603-1K27-0.1%-1/10W) 0603
- (in symbol RESC-0603-1K-0.1%-1/10W) 0603
- (in symbol RESC-0603-1M54-0.1%-1/10W) 0603
- (in symbol RESC-0603-2K05-0.1%-1/10W) 0603
- (in symbol RESC-0603-2K21-0.1%-1/10W) 0603
- (in symbol RESC-0603-2M74-0.1%-1/10W) 0603
- (in symbol RESC-0603-4M75-1%-1/10W) 0603
- (in symbol RESC-0603-10K-0.1%-1/10W) 0603
- (in symbol RESC-0603-42K2-0.1%-1/10W) 0603
- (in symbol RESC-0603-44K2-0.1%-1/10W) 0603
- (in symbol RESC-0603-511K-0.1%-1/10W) 0603
- (in symbol RESC-0805-1K54-0.1%-1/4W) 0805
- (in symbol RESC-0805-2K49-0.1%-1/4W) 0805
- (in symbol RESC-1206-1K8-0.1%-1/2W) 1206
- (in symbol RESC-1206-20R-0.1%-1/2W) 1206
- (in symbol RESC-1206-180R-0.1%-1/2W) 1206

### Library data of the parts
C26 C28 = CAPP-AE-47uF-100V-TH050P100D140H: CAPACITOR,ALU,47uF,100V,TH,P5mm,D10mm,H14mm; Manufacturer 1: KEMET; Manufacturer Part Number 1: ESL476M100AH9AA; Location: *; DIGIKEY: 399-15746-ND
C27 = CAPC-0603-10PF-50V-C0G: CAPACITOR,CERAMIC,10pF,50V,C0G,0603; Manufacturer 1: KYOCERA; Manufacturer Part Number 1: C0603C100J5GAC; Package / Case: 0603; Location: *; MOUSER: 80-C0603C100J5GAC
C68-C71 C83 C84 = CAPC-0603-100nF-50V-X7R: CAPACITOR,CERAMIC,100nF,50V,X7R,0603; Manufacturer 1: KEMET; Manufacturer Part Number 1: C0603C104K5RACTU; Package / Case: 0603; Location: *; Supplier 1: Mouser; Supplier Part Number 1: 80-C0603C104K5R7867; Supplier 2: Mouser; Supplier Part Number 2: 80-C0603C104K5R7411; Supplier 3: Avnet; Supplier Part Number 3: KGM15BR71H104KT; Supplier 4: Digikey; Supplier Part Number 4: 1276-1000-1-ND; LCSC: C127833; MOUSER: 80-C0603C104K5R
C81 = CAPC-0603-1n5-50V-X7R: CAPACITOR,CERAMIC,1n5,50V,X7R,0603; Package / Case: 0603; Location: *
D34 D35 D215 D231 = DIODE-ONSEMI-NRVA4007T3G: as D60 on sheet PSU; DIGIKEY: NRVA4007T3GOSCT-ND; Manufacturer 1: ONSEMI; Manufacturer Part Number 1: NRVA4007T3G
D36 D37 = DIODE-RECTIFIER-DIODES-BAS16-SOT23: as D41 on sheet PSU
HS9 = HEATSINK-CUI-HSS01-B20-CP: HEATSINKSTAMPED,CLIP-ON,BOARDMOUNT,3W,25C/W,CUI,HSS01-B20-CP; DIGIKEY: HSS01-B20-CP; Manufacturer 1: CUI; Manufacturer Part Number 1: HSS01-B20-CP
K1 K2 = RELAY-KEMET-UA2-5NJ: RELAY,DPDT,1A,250VAC,220VDC,5V COIL,KEMET,UA2-5NJ; DIGIKEY: 399-UA2-5NJ-ND; Manufacturer 1: KEMET; Manufacturer Part Number 1: UA2-5NJ
Q9 Q10 = XSTR-NPN-BC847: XSTR,NPN,45V,0.1A,,BC847B,SOT23
R78 R107 VR211 = TRIMMER-BOURNS-3214X-1-103E: RESISTOR,MULTITURN,VERTICAL,5T,10K; Manufacturer 1: BOURNS; Manufacturer Part Number 1: 3214X-1-102E
R79 R316 = RESC-0603-2M74-0.1%-1/10W: RESISTOR,2M74,0.1%,100mW,0603 (1608); Location: *
R80 R103 = RESC-0603-44K2-0.1%-1/10W: RESISTOR,44K2,0.1%,100mW,0603 (1608); Location: *
R81 R86 = RESC-0603-2K21-0.1%-1/10W: RESISTOR,2K21,0.1%,100mW,0603 (1608); Location: *
R82 R87 = RESC-1206-1K8-0.1%-1/2W: RESISTOR,1K8,1206,0.1%,520mW,1206; Manufacturer 1: VISHAY; Manufacturer Part Number 1: TNPW12061K80BEEA; Location: *; Parameter 4: *
R83 R88 = RESC-1206-180R-0.1%-1/2W: RESISTOR,180,1206,0.1%,520mW,1206; Manufacturer 1: VISHAY; Manufacturer Part Number 1: TNPW1206180RBEEA; Location: *; Parameter 4: *
R84 R85 R89-R92 R97 R98 = RESC-1206-20R-0.1%-1/2W: RESISTOR,20R,1206,0.1%,520mW,1206; Manufacturer 1: VISHAY; Manufacturer Part Number 1: TNPW120620R0BEEA; Location: *; Parameter 4: *
R93 = RESC-0805-2K49-0.1%-1/4W: RESISTOR,2K49,0.1%,250mW,0805; Manufacturer 1: TE; Manufacturer Part Number 1: RP73PF2A2K49BTDF; Location: *; Parameter 4: *
R94 R95 = RESC-0805-1K54-0.1%-1/4W: RESISTOR,1K54,0.1%,250mW,0805; Manufacturer 1: TE; Manufacturer Part Number 1: RP73PF2A1K54BTDF; Location: *; Parameter 4: *
R96 R99 R100 = TRIMMER-BOURNS-3214X-1-102E: RESISTOR,MULTITURN,VERTICAL,5T,1K; Manufacturer 1: BOURNS; Manufacturer Part Number 1: 3214X-1-102E
R101 R102 R242 R243 = RESC-0603-10K-0.1%-1/10W: RESISTOR,10K,0.1%,100mW,0603 (1608); Manufacturer 1: PANASONIC; Manufacturer Part Number 1: ERA-3AEB103V; Location: *; DIGIKEY: P10KDBCT-ND
R104 = RESC-0603-511K-0.1%-1/10W: RESISTOR,511K,0.1%,100mW,0603 (1608); Location: *
R105 = RESC-0603-1M54-0.1%-1/10W: RESISTOR,1M54,0.1%,100mW,0603 (1608); Location: *
R106 R108 = RESC-0603-2K05-0.1%-1/10W: RESISTOR,2K05,0.11%,100mW,0603 (1608); Location: *
R241 = RESC-0603-4M75-1%-1/10W: RESISTOR,4M75,0.1%,100mW,0603 (1608); Location: *
R257 = RESC-0603-1K-0.1%-1/10W: RESISTOR,1K,0.1%,100mW,0603 (1608); Location: *
R261 = RESC-0603-42K2-0.1%-1/10W: RESISTOR,42K2,0.1%,100mW,0603 (1608); Location: *
R314 = RESC-0603-1K27-0.1%-1/10W: RESISTOR,1K27,0.1%,100mW,0603 (1608); Location: *
U11 = IC-TI-LM675-TO220-5: IC,OPAMP,SINGLE,POWER,LM675,TO220-5
U13 U213 = IC-TI-CD4053-SPLIT: IC,LOGIC,CMOS,4XXX,TRIPLE 2:1 MUX,SPLIT BLOCKS
U30-U32 = IC-TI-TL082H-SO8: IC,OPAMP JFET,DUAL,TL082HIDR,SO8; Manufacturer 1: TI; Manufacturer Part Number 1: TL082HIDR; MOUSER: 595-TL082HIDR
VR202 = TRIMMER-BOURNS-3214X-1-104: RESISTOR,MULTITURN,VERTICAL,5T,100K; Manufacturer 1: BOURNS; Manufacturer Part Number 1: 3214X-1-102E

## Sheet IBVG-DRIVER.SchDoc
size Tabloid; SheetNumber: 5; SheetTotal: 10
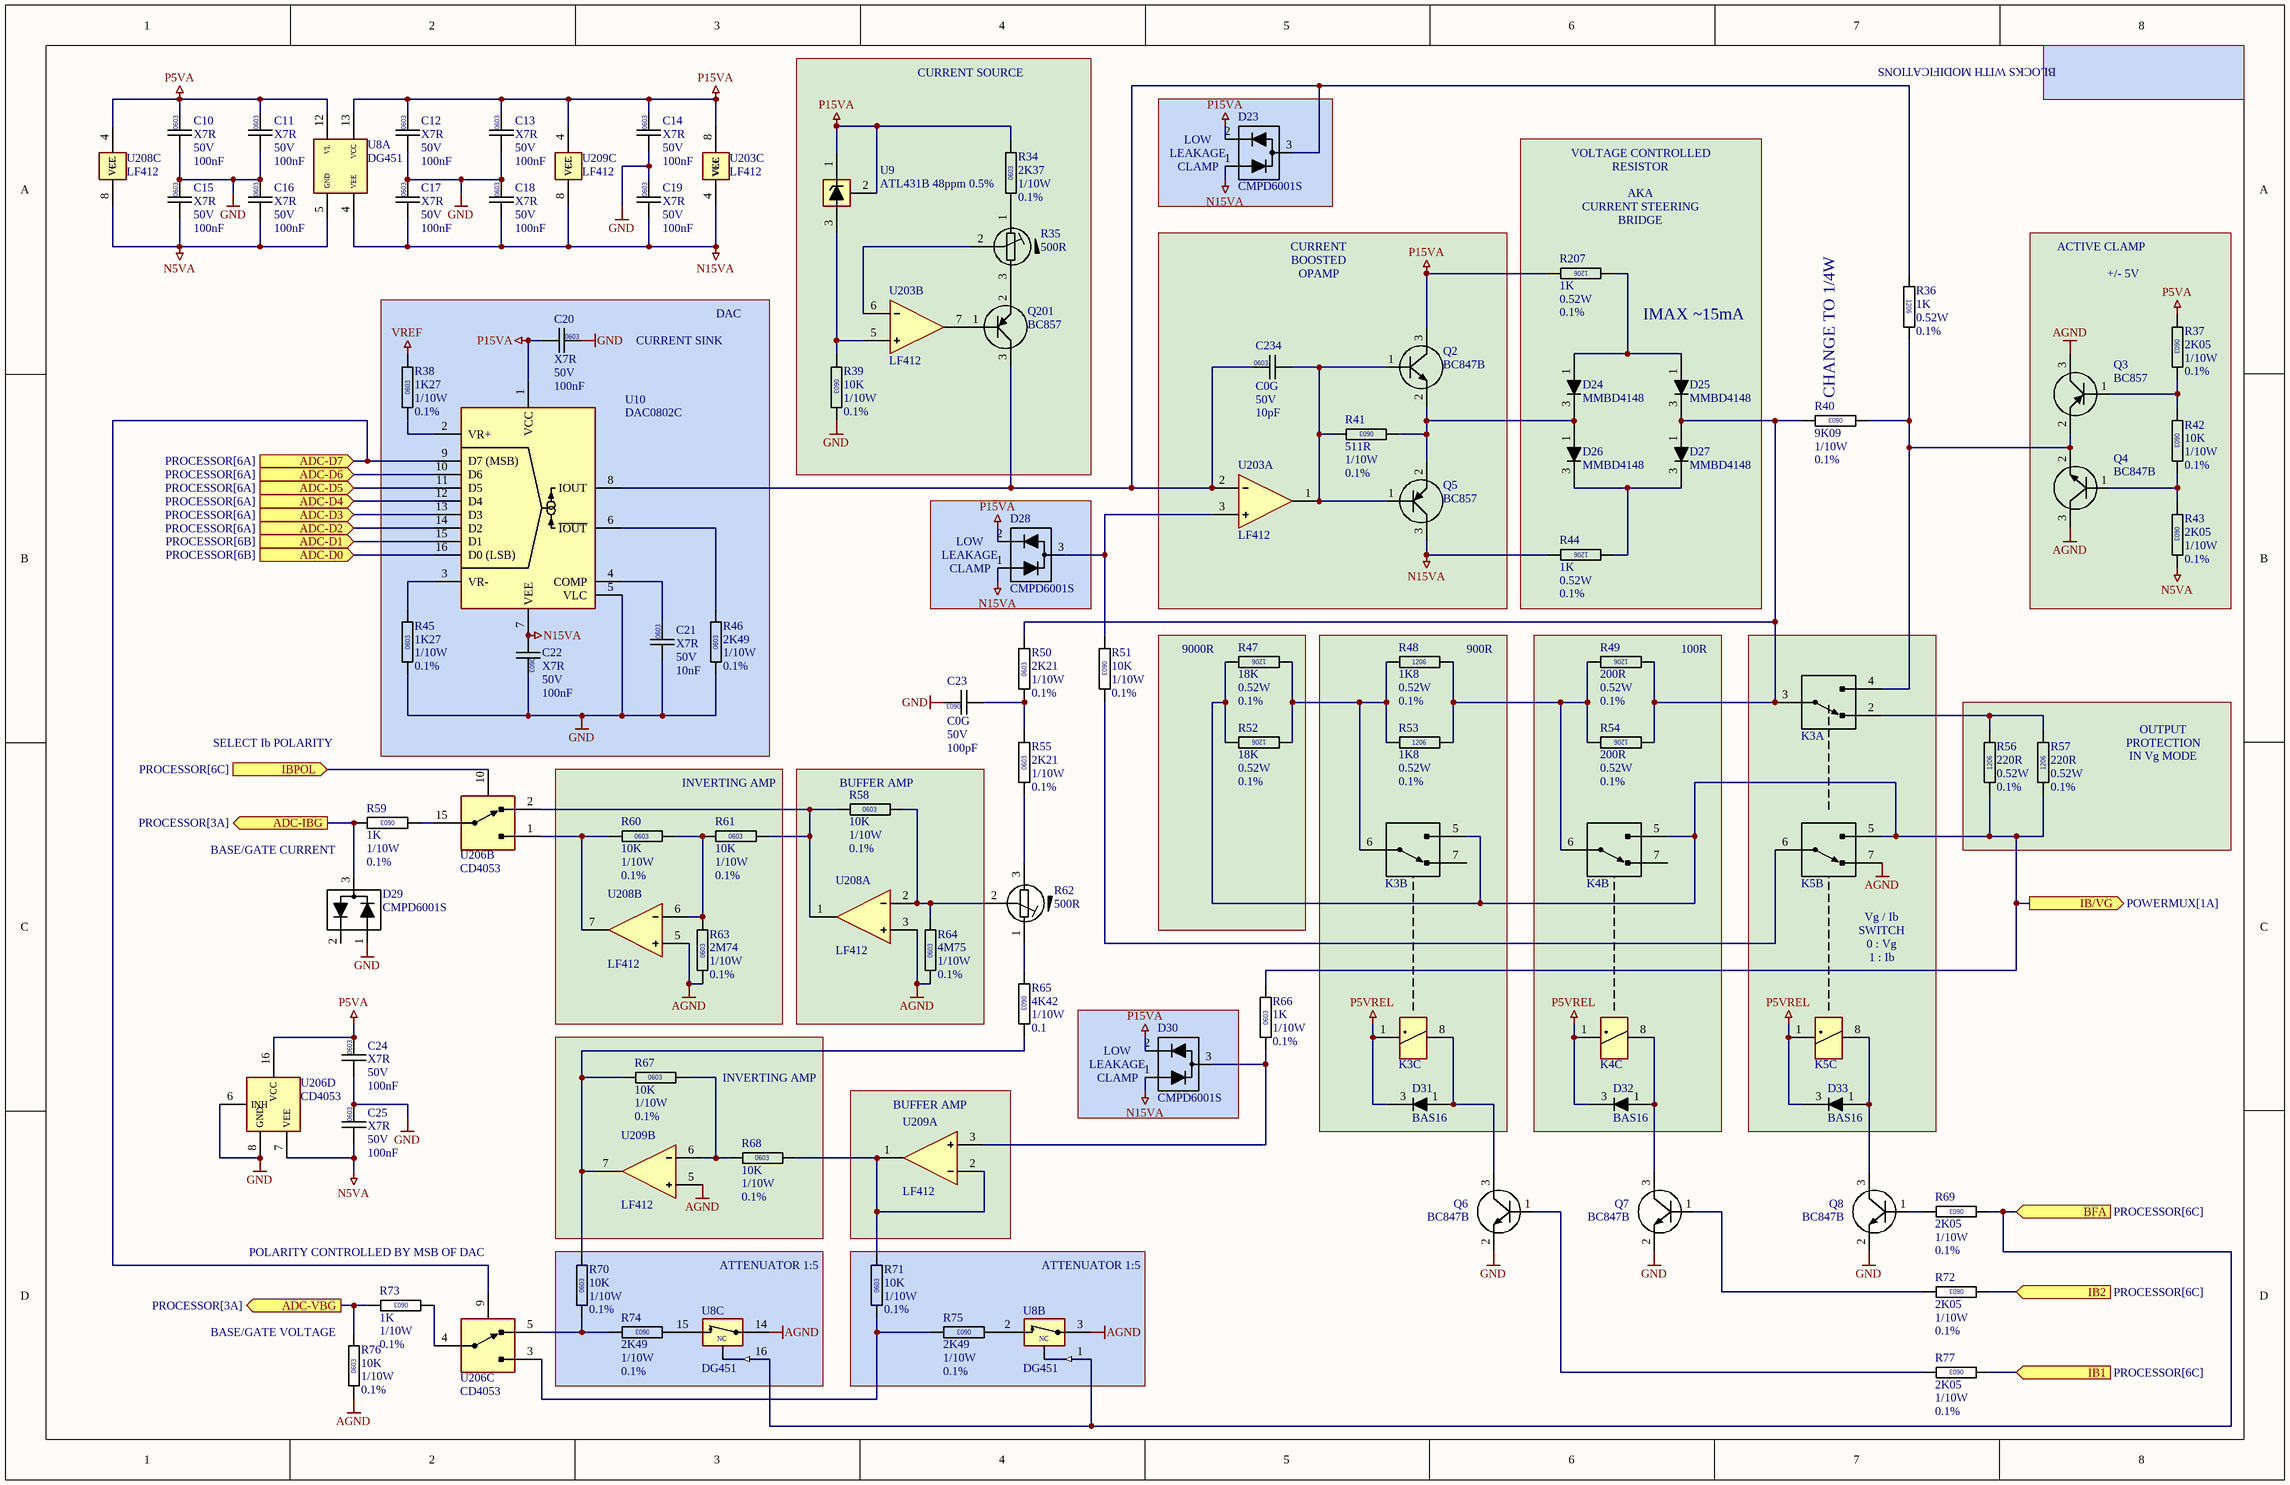
[diagram p3: IBVG-DRIVER.SchDoc]

### Parts
C10  Dielectric: X7R  Voltage: 50V  Capacitance: 100nF  [CAPC0603]  (hidden comment: CAP0603)
C11  Dielectric: X7R  Voltage: 50V  Capacitance: 100nF  [CAPC0603]  (hidden comment: CAP0603)
C12  Dielectric: X7R  Voltage: 50V  Capacitance: 100nF  [CAPC0603]  (hidden comment: CAP0603)
C13  Dielectric: X7R  Voltage: 50V  Capacitance: 100nF  [CAPC0603]  (hidden comment: CAP0603)
C14  Dielectric: X7R  Voltage: 50V  Capacitance: 100nF  [CAPC0603]  (hidden comment: CAP0603)
C15  Dielectric: X7R  Voltage: 50V  Capacitance: 100nF  [CAPC0603]  (hidden comment: CAP0603)
C16  Dielectric: X7R  Voltage: 50V  Capacitance: 100nF  [CAPC0603]  (hidden comment: CAP0603)
C17  Dielectric: X7R  Voltage: 50V  Capacitance: 100nF  [CAPC0603]  (hidden comment: CAP0603)
C18  Dielectric: X7R  Voltage: 50V  Capacitance: 100nF  [CAPC0603]  (hidden comment: CAP0603)
C19  Dielectric: X7R  Voltage: 50V  Capacitance: 100nF  [CAPC0603]  (hidden comment: CAP0603)
C20  Dielectric: X7R  Voltage: 50V  Capacitance: 100nF  [CAPC0603]  (hidden comment: CAP0603)
C21  Dielectric: X7R  Voltage: 50V  Capacitance: 10nF  [CAPC0603]  (hidden comment: CAP0603)
C22  Dielectric: X7R  Voltage: 50V  Capacitance: 100nF  [CAPC0603]  (hidden comment: CAP0603)
C23  Dielectric: C0G  Voltage: 50V  Capacitance: 100pF  [CAPC0603]  (hidden comment: CAP0603)
C24  Dielectric: X7R  Voltage: 50V  Capacitance: 100nF  [CAPC0603]  (hidden comment: CAP0603)
C25  Dielectric: X7R  Voltage: 50V  Capacitance: 100nF  [CAPC0603]  (hidden comment: CAP0603)
C234  Dielectric: C0G  Voltage: 50V  Capacitance: 10pF  [CAPC0603]  (hidden comment: CAP0603)
D23  CMPD6001S  [SOT23]
D24  MMBD4148
D25  MMBD4148
D26  MMBD4148
D27  MMBD4148
D28  CMPD6001S  [SOT23]
D29  CMPD6001S  [SOT23]
D30  CMPD6001S  [SOT23]
D31  BAS16  [SOT23]
D32  BAS16  [SOT23]
D33  BAS16  [SOT23]
K3  RELAY-KEMET-UA2-5NJ  [RELAY-KEMET-UA2-5NJ]  (value not drawn)  (parts A,B,C of 3)
K4  RELAY-KEMET-UA2-5NJ  [RELAY-KEMET-UA2-5NJ]  (value not drawn)  (parts B,C of 3)
K5  RELAY-KEMET-UA2-5NJ  [RELAY-KEMET-UA2-5NJ]  (value not drawn)  (parts B,C of 3)
Q2  BC847B  [SOT23]
Q3  BC857  [SOT23]
Q4  BC847B  [SOT23]
Q5  BC857  [SOT23]
Q6  BC847B  [SOT23]
Q7  BC847B  [SOT23]
Q8  BC847B  [SOT23]
Q201  BC857  [SOT23]
R34  value 2K37  Power: 1/10W  Tolerance: 0.1%  [RESC0603]  (hidden comment: RESC0603)
R35  value 500R  [TRIMMER-BOURNS-3214X]  (hidden comment: TRIMMER-BOURNS-3214X-1-501)
R36  value 1K  Power: 0.52W  Tolerance: 0.1%  [RESC1206]  (hidden comment: RESC1206)
R37  value 2K05  Power: 1/10W  Tolerance: 0.1%  [RESC0603]  (hidden comment: RESC0603)
R38  value 1K27  Power: 1/10W  Tolerance: 0.1%  [RESC0603]  (hidden comment: RESC0603)
R39  value 10K  Power: 1/10W  Tolerance: 0.1%  [RESC0603]  (hidden comment: RESC0603)
R40  value 9K09  Power: 1/10W  Tolerance: 0.1%  [RESC0603]  (hidden comment: RESC0603)
R41  value 511R  Power: 1/10W  Tolerance: 0.1%  [RESC0603]  (hidden comment: RESC0603)
R42  value 10K  Power: 1/10W  Tolerance: 0.1%  [RESC0603]  (hidden comment: RESC0603)
R43  value 2K05  Power: 1/10W  Tolerance: 0.1%  [RESC0603]  (hidden comment: RESC0603)
R44  value 1K  Power: 0.52W  Tolerance: 0.1%  [RESC1206]  (hidden comment: RESC1206)
R45  value 1K27  Power: 1/10W  Tolerance: 0.1%  [RESC0603]  (hidden comment: RESC0603)
R46  value 2K49  Power: 1/10W  Tolerance: 0.1%  [RESC0603]  (hidden comment: RESC0603)
R47  value 18K  Power: 0.52W  Tolerance: 0.1%  [RESC1206]  (hidden comment: RESC1206)
R48  value 1K8  Power: 0.52W  Tolerance: 0.1%  [RESC1206]  (hidden comment: RESC1206)
R49  value 200R  Power: 0.52W  Tolerance: 0.1%  [RESC1206]  (hidden comment: RESC1206)
R50  value 2K21  Power: 1/10W  Tolerance: 0.1%  [RESC0603]  (hidden comment: RESC0603)
R51  value 10K  Power: 1/10W  Tolerance: 0.1%  [RESC0603]  (hidden comment: RESC0603)
R52  value 18K  Power: 0.52W  Tolerance: 0.1%  [RESC1206]  (hidden comment: RESC1206)
R53  value 1K8  Power: 0.52W  Tolerance: 0.1%  [RESC1206]  (hidden comment: RESC1206)
R54  value 200R  Power: 0.52W  Tolerance: 0.1%  [RESC1206]  (hidden comment: RESC1206)
R55  value 2K21  Power: 1/10W  Tolerance: 0.1%  [RESC0603]  (hidden comment: RESC0603)
R56  value 220R  Power: 0.52W  Tolerance: 0.1%  [RESC1206]  (hidden comment: RESC1206)
R57  value 220R  Power: 0.52W  Tolerance: 0.1%  [RESC1206]  (hidden comment: RESC1206)
R58  value 10K  Power: 1/10W  Tolerance: 0.1%  [RESC0603]  (hidden comment: RESC0603)
R59  value 1K  Power: 1/10W  Tolerance: 0.1%  [RESC0603]  (hidden comment: RESC0603)
R60  value 10K  Power: 1/10W  Tolerance: 0.1%  [RESC0603]  (hidden comment: RESC0603)
R61  value 10K  Power: 1/10W  Tolerance: 0.1%  [RESC0603]  (hidden comment: RESC0603)
R62  value 500R  [TRIMMER-BOURNS-3214X]  (hidden comment: TRIMMER-BOURNS-3214X-1-501)
R63  value 2M74  Power: 1/10W  Tolerance: 0.1%  [RESC0603]  (hidden comment: RESC0603)
R64  value 4M75  Power: 1/10W  Tolerance: 0.1%  [RESC0603]  (hidden comment: RESC0603)
R65  value 4K42  Power: 1/10W  Tolerance: 0.1  [RESC0603]  (hidden comment: RESC0603)
R66  value 1K  Power: 1/10W  Tolerance: 0.1%  [RESC0603]  (hidden comment: RESC0603)
R67  value 10K  Power: 1/10W  Tolerance: 0.1%  [RESC0603]  (hidden comment: RESC0603)
R68  value 10K  Power: 1/10W  Tolerance: 0.1%  [RESC0603]  (hidden comment: RESC0603)
R69  value 2K05  Power: 1/10W  Tolerance: 0.1%  [RESC0603]  (hidden comment: RESC0603)
R70  value 10K  Power: 1/10W  Tolerance: 0.1%  [RESC0603]  (hidden comment: RESC0603)
R71  value 10K  Power: 1/10W  Tolerance: 0.1%  [RESC0603]  (hidden comment: RESC0603)
R72  value 2K05  Power: 1/10W  Tolerance: 0.1%  [RESC0603]  (hidden comment: RESC0603)
R73  value 1K  Power: 1/10W  Tolerance: 0.1%  [RESC0603]  (hidden comment: RESC0603)
R74  value 2K49  Power: 1/10W  Tolerance: 0.1%  [RESC0603]  (hidden comment: RESC0603)
R75  value 2K49  Power: 1/10W  Tolerance: 0.1%  [RESC0603]  (hidden comment: RESC0603)
R76  value 10K  Power: 1/10W  Tolerance: 0.1%  [RESC0603]  (hidden comment: RESC0603)
R77  value 2K05  Power: 1/10W  Tolerance: 0.1%  [RESC0603]  (hidden comment: RESC0603)
R207  value 1K  Power: 0.52W  Tolerance: 0.1%  [RESC1206]  (hidden comment: RESC1206)
U8  DG451  [SO127P600-16N]  (parts A,B,C of 5)
U9  ATL431B 48ppm 0.5%  [SOT23]
U10  DAC0802C
U203  LF412  [SO127P600-8N]  (parts A,B,C of 3)
U206  CD4053  [SO127P600-16N]  (parts B,C,D of 4)
U208  LF412  [SO127P600-8N]  (parts A,B,C of 3)
U209  LF412  [SO127P600-8N]  (parts A,B,C of 3)

### Blocks framed on the sheet
CURRENT SOURCE: Q201 R34 R35 R39 U9 U203
IMAX ~15mA: D24-D27 R44 R207
9000R: R47 R52
900R: D31 K3 R48 R53
100R: D32 K4 R49 R54
INVERTING AMP: R60 R61 R63 U208
BUFFER AMP: R58 R64 U208
INVERTING AMP: R67 R68 U209
BUFFER AMP: U209
ATTENUATOR 1:5: R70 R74 U8
ATTENUATOR 1:5: R71 R75 U8

### Ports
ADC-D0 (in, see PROCESSOR[6B]), ADC-D1 (in, see PROCESSOR[6B]), ADC-D2 (in, see PROCESSOR[6A]), ADC-D3 (in, see PROCESSOR[6A]), ADC-D4 (in, see PROCESSOR[6A]), ADC-D5 (in, see PROCESSOR[6A]), ADC-D6 (in, see PROCESSOR[6A]), ADC-D7 (in, see PROCESSOR[6A]), ADC-IBG (out, see PROCESSOR[3A]), ADC-VBG (out, see PROCESSOR[3A]), BFA (in, see PROCESSOR[6C]), IB1 (in, see PROCESSOR[6C]), IB2 (in, see PROCESSOR[6C]), IB/VG (out, see POWERMUX[1A]), IBPOL (in, see PROCESSOR[6C])

### Nets
AGND: K5.7(NC) Q3.3(C) Q4.3(C) R63.2 R64.2 R76.2 U8.3 U8.14 U208.3(+) U208.5(+) U209.5(+)
GND: C10.2 C11.2 C12.2 C13.2 C14.2 C15.1 C16.1 C17.1 C18.1 C19.1 C20.1 C21.2 C22.1 C23.1 C24.2 C25.1 D29.1(K) Q6.2(E) Q7.2(E) Q8.2(E) R39.1 R45.2 R46.2 U10.5(VLC) U206.6(INH) U206.8(GND)
N5VA: C15.2 C16.2 C25.2 R43.2 U8.5(GND) U206.7(VEE) U208.8(VCC)
N15VA: C17.2 C18.2 C19.2 C22.2 D23.1(K) D28.1(K) D30.1(K) Q5.3(C) R44.1 U8.4(VEE) U10.7(VEE) U203.4(VEE) U209.8(VCC)
P5VA: C10.1 C11.1 C24.1 R37.1 U8.12(VL) U206.16(VCC) U208.4(VEE)
P5VREL: D31.3(K) D32.3(K) D33.3(K) K3.1 K4.1 K5.1
P15VA: C12.1 C13.1 C14.1 C20.2 D23.2(A) D28.2(A) D30.2(A) Q2.3(C) R34.1 R207.1 U8.13(VCC) U9.1 U9.2 U10.1(VCC) U203.8(VCC) U209.4(VEE)
VREF: R38.1
ADC-D0: U10.16(D0_(LSB)) ; port ADC-D0
ADC-D1: U10.15(D1) ; port ADC-D1
ADC-D2: U10.14(D2) ; port ADC-D2
ADC-D3: U10.13(D3) ; port ADC-D3
ADC-D4: U10.12(D4) ; port ADC-D4
ADC-D5: U10.11(D5) ; port ADC-D5
ADC-D6: U10.10(D6) ; port ADC-D6
ADC-D7: U10.9(D7_(MSB)) U206.9(B) ; port ADC-D7
ADC-IBG: D29.3(A) R59.1 ; port ADC-IBG
ADC-VBG: R73.1 R76.1 ; port ADC-VBG
BFA: R69.1 U8.1 U8.16 ; port BFA
IB1: R77.1 ; port IB1
IB2: R72.1 ; port IB2
IB/VG: K3.5(NO) K4.5(NO) K5.5(NO) R47.2 R52.2 R56.2 R57.2 R66.1 ; port IB/VG
IBPOL: U206.10(A) ; port IBPOL
NetC21_1: C21.1 U10.4(COMP)
NetC23_2: C23.2 R50.2 R55.1
NetC234_1: C234.1 D23.3(A) Q201.3(C) R36.2 U10.8(IOUT) U203.2(-)
NetC234_2: C234.2 Q2.1(B) Q5.1(B) R41.1 U203.1(O)
NetD24_1: D24.1(A) D25.1(A) R207.2
NetD24_3: D24.3(K) D26.1(A) Q2.2(E) Q5.2(E) R41.2
NetD25_3: D25.3(K) D27.1(A) K3.3(COM) R40.1 R49.1 R50.1 R54.1
NetD26_3: D26.3(K) D27.3(K) R44.2
NetD28_3: D28.3(A) R51.2 U203.3(+)
NetD30_3: D30.3(A) R66.2 U209.3(+)
NetD31_1: D31.1(A) K3.8 Q6.3(C)
NetD32_1: D32.1(A) K4.8 Q7.3(C)
NetD33_1: D33.1(A) K5.8 Q8.3(C)
NetK3_2: K3.2(NC) R56.1 R57.1
NetK3_4: K3.4(NO) Q3.2(E) Q4.2(E) R36.1 R40.2
NetK3_6: K3.6(COM) R47.1 R48.1 R52.1 R53.1
NetK4_6: K4.6(COM) R48.2 R49.2 R53.2 R54.2
NetK5_6: K5.6(COM) R51.1
NetQ3_1: Q3.1(B) R37.2 R42.2
NetQ4_1: Q4.1(B) R42.1 R43.1
NetQ6_1: Q6.1(B) R77.2
NetQ7_1: Q7.1(B) R72.2
NetQ8_1: Q8.1(B) R69.2
NetQ201_1: Q201.1(B) U203.7(O)
NetQ201_2: Q201.2(E) R35.3
NetR34_2: R34.2 R35.1
NetR35_2: R35.2 U203.6(-)
NetR38_2: R38.2 U10.2(VR+)
NetR39_2: R39.2 U9.3 U203.5(+)
NetR45_1: R45.1 U10.3(VR-)
NetR46_1: R46.1 U10.6(~{IOUT})
NetR55_2: R55.2 R62.3
NetR58_1: R58.1 R62.2 R64.1 U208.2(-)
NetR58_2: R58.2 R61.1 U206.2(Y2) U208.1(O)
NetR59_2: R59.2 U206.15(X2)
NetR60_1: R60.1 R61.2 R63.1 U208.6(-)
NetR60_2: R60.2 U206.1(Y0) U208.7(O)
NetR62_1: R62.1 R65.2
NetR65_1: R65.1 R67.2 R70.1 U209.7(O)
NetR67_1: R67.1 R68.2 U209.6(-)
NetR68_1: R68.1 R71.1 U209.1(O) U209.2(-)
NetR70_2: R70.2 R74.1 U206.5(Y1)
NetR71_2: R71.2 R75.1 U206.3(Y)
NetR73_2: R73.2 U206.4(Y3)
NetR74_2: R74.2 U8.15
NetR75_2: R75.2 U8.2

Not connected (* = marked no-connect by the designer): D29 2(A); K3 7(NC); K4 7(NC)

### Notes on the sheet
- BLOCKS WITH MODIFICATIONS
- (near D23) LOW
- (near D23) LEAKAGE
- (near D23) CLAMP
- VOLTAGE CONTROLLED
- RESISTOR
- AKA
- CURRENT STEERING
- (near R207) BRIDGE
- CURRENT
- BOOSTED
- OPAMP
- ACTIVE CLAMP
- +/- 5V
- CURRENT SINK
- DAC
- (near R40) CHANGE TO 1/4W
- (near D28) LOW
- (near D28) LEAKAGE
- (near D28) CLAMP
- SELECT Ib POLARITY
- PROTECTION
- IN Vg MODE
- OUTPUT
- BASE/GATE CURRENT
- SWITCH
- 0 : Vg
- (near K5) Vg / Ib
- 1 : Ib
- (near D30) LOW
- (near D30) LEAKAGE
- (near D30) CLAMP
- POLARITY CONTROLLED BY MSB OF DAC
- (near R76) BASE/GATE VOLTAGE
- (in symbol IC-SILICONIX-DG451, part B) NC
- (in symbol IC-SILICONIX-DG451, part C) NC
- (in symbol RESC-0603-1K27-0.1%-1/10W) 0603
- (in symbol RESC-0603-1K-0.1%-1/10W) 0603
- (in symbol RESC-0603-2K05-0.1%-1/10W) 0603
- (in symbol RESC-0603-2K21-0.1%-1/10W) 0603
- (in symbol RESC-0603-2K37-0.1%-1/10W) 0603
- (in symbol RESC-0603-2K49-0.1%-1/10W) 0603
- (in symbol RESC-0603-2M74-0.1%-1/10W) 0603
- (in symbol RESC-0603-4K42-0.1%-1/10W) 0603
- (in symbol RESC-0603-4M75-1%-1/10W) 0603
- (in symbol RESC-0603-9K09-0.1%-1/10W) 0603
- (in symbol RESC-0603-10K-0.1%-1/10W) 0603
- (in symbol RESC-0603-511R-0.1%-1/10W) 0603
- (in symbol RESC-1206-1K8-0.1%-1/2W) 1206
- (in symbol RESC-1206-1K-0.1%-1/2W) 1206
- (in symbol RESC-1206-18K-0.1%-1/2W) 1206
- (in symbol RESC-1206-200R-0.1%-1/2W) 1206
- (in symbol RESC-1206-220R-0.1%-1/2W) 1206

### Library data of the parts
C10-C20 C22 C24 C25 = CAPC-0603-100nF-50V-X7R: as C68 on sheet POWERAMP; Package / Case: 0603; Location: *; Supplier 1: Mouser; Supplier Part Number 1: 80-C0603C104K5R7867; Supplier 2: Mouser; Supplier Part Number 2: 80-C0603C104K5R7411; Supplier 3: Avnet; Supplier Part Number 3: KGM15BR71H104KT; Supplier 4: Digikey; Supplier Part Number 4: 1276-1000-1-ND; LCSC: C127833; MOUSER: 80-C0603C104K5R
C21 = CAPC-0603-10nF-50V-X7R: CAPACITOR,CERAMIC,10nF,50V,X7R,0603; Package / Case: 0603; Location: *
C23 = CAPC-0603-100pF-50V-C0G: CAPACITOR,CERAMIC,100pF,50V,C0G,0603; Package / Case: 0603; Location: *
C234 = CAPC-0603-10PF-50V-C0G: as C27 on sheet POWERAMP; Package / Case: 0603; Location: *; MOUSER: 80-C0603C100J5GAC
D23 D28-D30 = DIODE-CENTRALSEMI-CMPD6001S: DIODE,75V,250mA,SOT23,500pA ULTRA LOW LEAKAGE; Manufacturer 1: CENTRAL SEMICONDUCTOR; Manufacturer Part Number 1: CMPD6001S
D24-D27 = DIODE-RECTIFIER-DIODES-MMBD4148-SOT23: DIODE,RECTIFIER,75V,0.3A,MMBD4148,SOT23; Manufacturer 1: DIODES; Manufacturer Part Number 1: MMBD4148
D31-D33 = DIODE-RECTIFIER-DIODES-BAS16-SOT23: as D41 on sheet PSU
K3-K5 = RELAY-KEMET-UA2-5NJ: as K1 on sheet POWERAMP; DIGIKEY: 399-UA2-5NJ-ND; Manufacturer 1: KEMET; Manufacturer Part Number 1: UA2-5NJ
Q2 Q4 Q6-Q8 = XSTR-NPN-BC847: XSTR,NPN,45V,0.1A,,BC847B,SOT23
Q3 Q5 Q201 = XSTR-PNP-BC857: XSTR,PNP,SOT23,BC857,SOT23; Manufacturer 1: NEXPERIA; Manufacturer Part Number 1: BC857BW,115; DIGIKEY: 1727-4869-1-ND
R34 = RESC-0603-2K37-0.1%-1/10W: RESISTOR,2K37,0.1%,100mW,0603 (1608); Location: *
R35 R62 = TRIMMER-BOURNS-3214X-1-501: RESISTOR,MULTITURN,VERTICAL,5T,500R; Manufacturer 1: BOURNS; Manufacturer Part Number 1: 3214X-1-501E
R36 R44 R207 = RESC-1206-1K-0.1%-1/2W: RESISTOR,1K,1206,0.1%,520mW,1206; Manufacturer 1: VISHAY; Manufacturer Part Number 1: TNPW12061K00BEEA; Location: *; Parameter 4: *
R37 R43 R69 R72 R77 = RESC-0603-2K05-0.1%-1/10W: RESISTOR,2K05,0.11%,100mW,0603 (1608); Location: *
R38 R45 = RESC-0603-1K27-0.1%-1/10W: RESISTOR,1K27,0.1%,100mW,0603 (1608); Location: *
R39 R42 R51 R58 R60 R61 R67 R68 R70 R71 R76 = RESC-0603-10K-0.1%-1/10W: as R101 on sheet POWERAMP; Location: *; DIGIKEY: P10KDBCT-ND
R40 = RESC-0603-9K09-0.1%-1/10W: RESISTOR,9K09,0.1%,100mW,0603 (1608); Location: *
R41 = RESC-0603-511R-0.1%-1/10W: RESISTOR,511R,0.1%,100mW,0603 (1608); Location: *
R46 R74 R75 = RESC-0603-2K49-0.1%-1/10W: RESISTOR,2K49,0.1%,100mW,0603 (1608); Location: *
R47 R52 = RESC-1206-18K-0.1%-1/2W: RESISTOR,18K,1206,0.1%,520mW,1206; Manufacturer 1: VISHAY; Manufacturer Part Number 1: TNPW1206220RBEEA; Location: *; Parameter 4: *
R48 R53 = RESC-1206-1K8-0.1%-1/2W: as R82 on sheet POWERAMP; Location: *; Parameter 4: *
R49 R54 = RESC-1206-200R-0.1%-1/2W: RESISTOR,200R,1206,0.1%,520mW,1206; Manufacturer 1: VISHAY; Manufacturer Part Number 1: TNPW1206200RBEEA; Location: *; Parameter 4: *
R50 R55 = RESC-0603-2K21-0.1%-1/10W: RESISTOR,2K21,0.1%,100mW,0603 (1608); Location: *
R56 R57 = RESC-1206-220R-0.1%-1/2W: RESISTOR,220R,1206,0.1%,520mW,1206; Manufacturer 1: VISHAY; Manufacturer Part Number 1: TNPW1206220RBEEA; Location: *; Parameter 4: *
R59 R66 R73 = RESC-0603-1K-0.1%-1/10W: RESISTOR,1K,0.1%,100mW,0603 (1608); Location: *
R63 = RESC-0603-2M74-0.1%-1/10W: RESISTOR,2M74,0.1%,100mW,0603 (1608); Location: *
R64 = RESC-0603-4M75-1%-1/10W: RESISTOR,4M75,0.1%,100mW,0603 (1608); Location: *
R65 = RESC-0603-4K42-0.1%-1/10W: RESISTOR,4K42,0.1%,100mW,0603 (1608); Location: *
U8 = IC-SILICONIX-DG451: IC,ANALOG,4XSPST ANALOG SWITCH,NC,,SILICONIX,DG451,SO16; Manufacturer 1: VISHAY SILICONIX; Manufacturer Part Number 1: DG451EY-T1-E3; DIGIKEY: DG451EY-T1-E3CT-ND
U9 = IC-TI-ATL431B-SOT23: IC,REGULATOR,REFERENCE,SHUNT,0.5%,48ppm,TL431,SOT23; Manufacturer 1: TI; Manufacturer Part Number 1: ATL431BIDBZR; DIGIKEY: 296-47739-1-ND
U10 = IC-TI-DAC0802LCMX/NOPB: IC,DAC,8 BIT,CURRENT DIFF,TI,DAC0802LCMX/NOPB,SO16; DIGIKEY: DAC0802LCMX/NOPBCT-ND; Manufacturer 1: TI; Manufacturer Part Number 1: DAC0802LCMX/NOPB
U203 U208 U209 = IC-TI-LF412-S08: IC,OPAMP JFET,DUAL,LF412,SO8
U206 = IC-TI-CD4053-SPLIT: as U13 on sheet POWERAMP

## Sheet SWEEP.SchDoc
size Tabloid; SheetNumber: 4; SheetTotal: 9
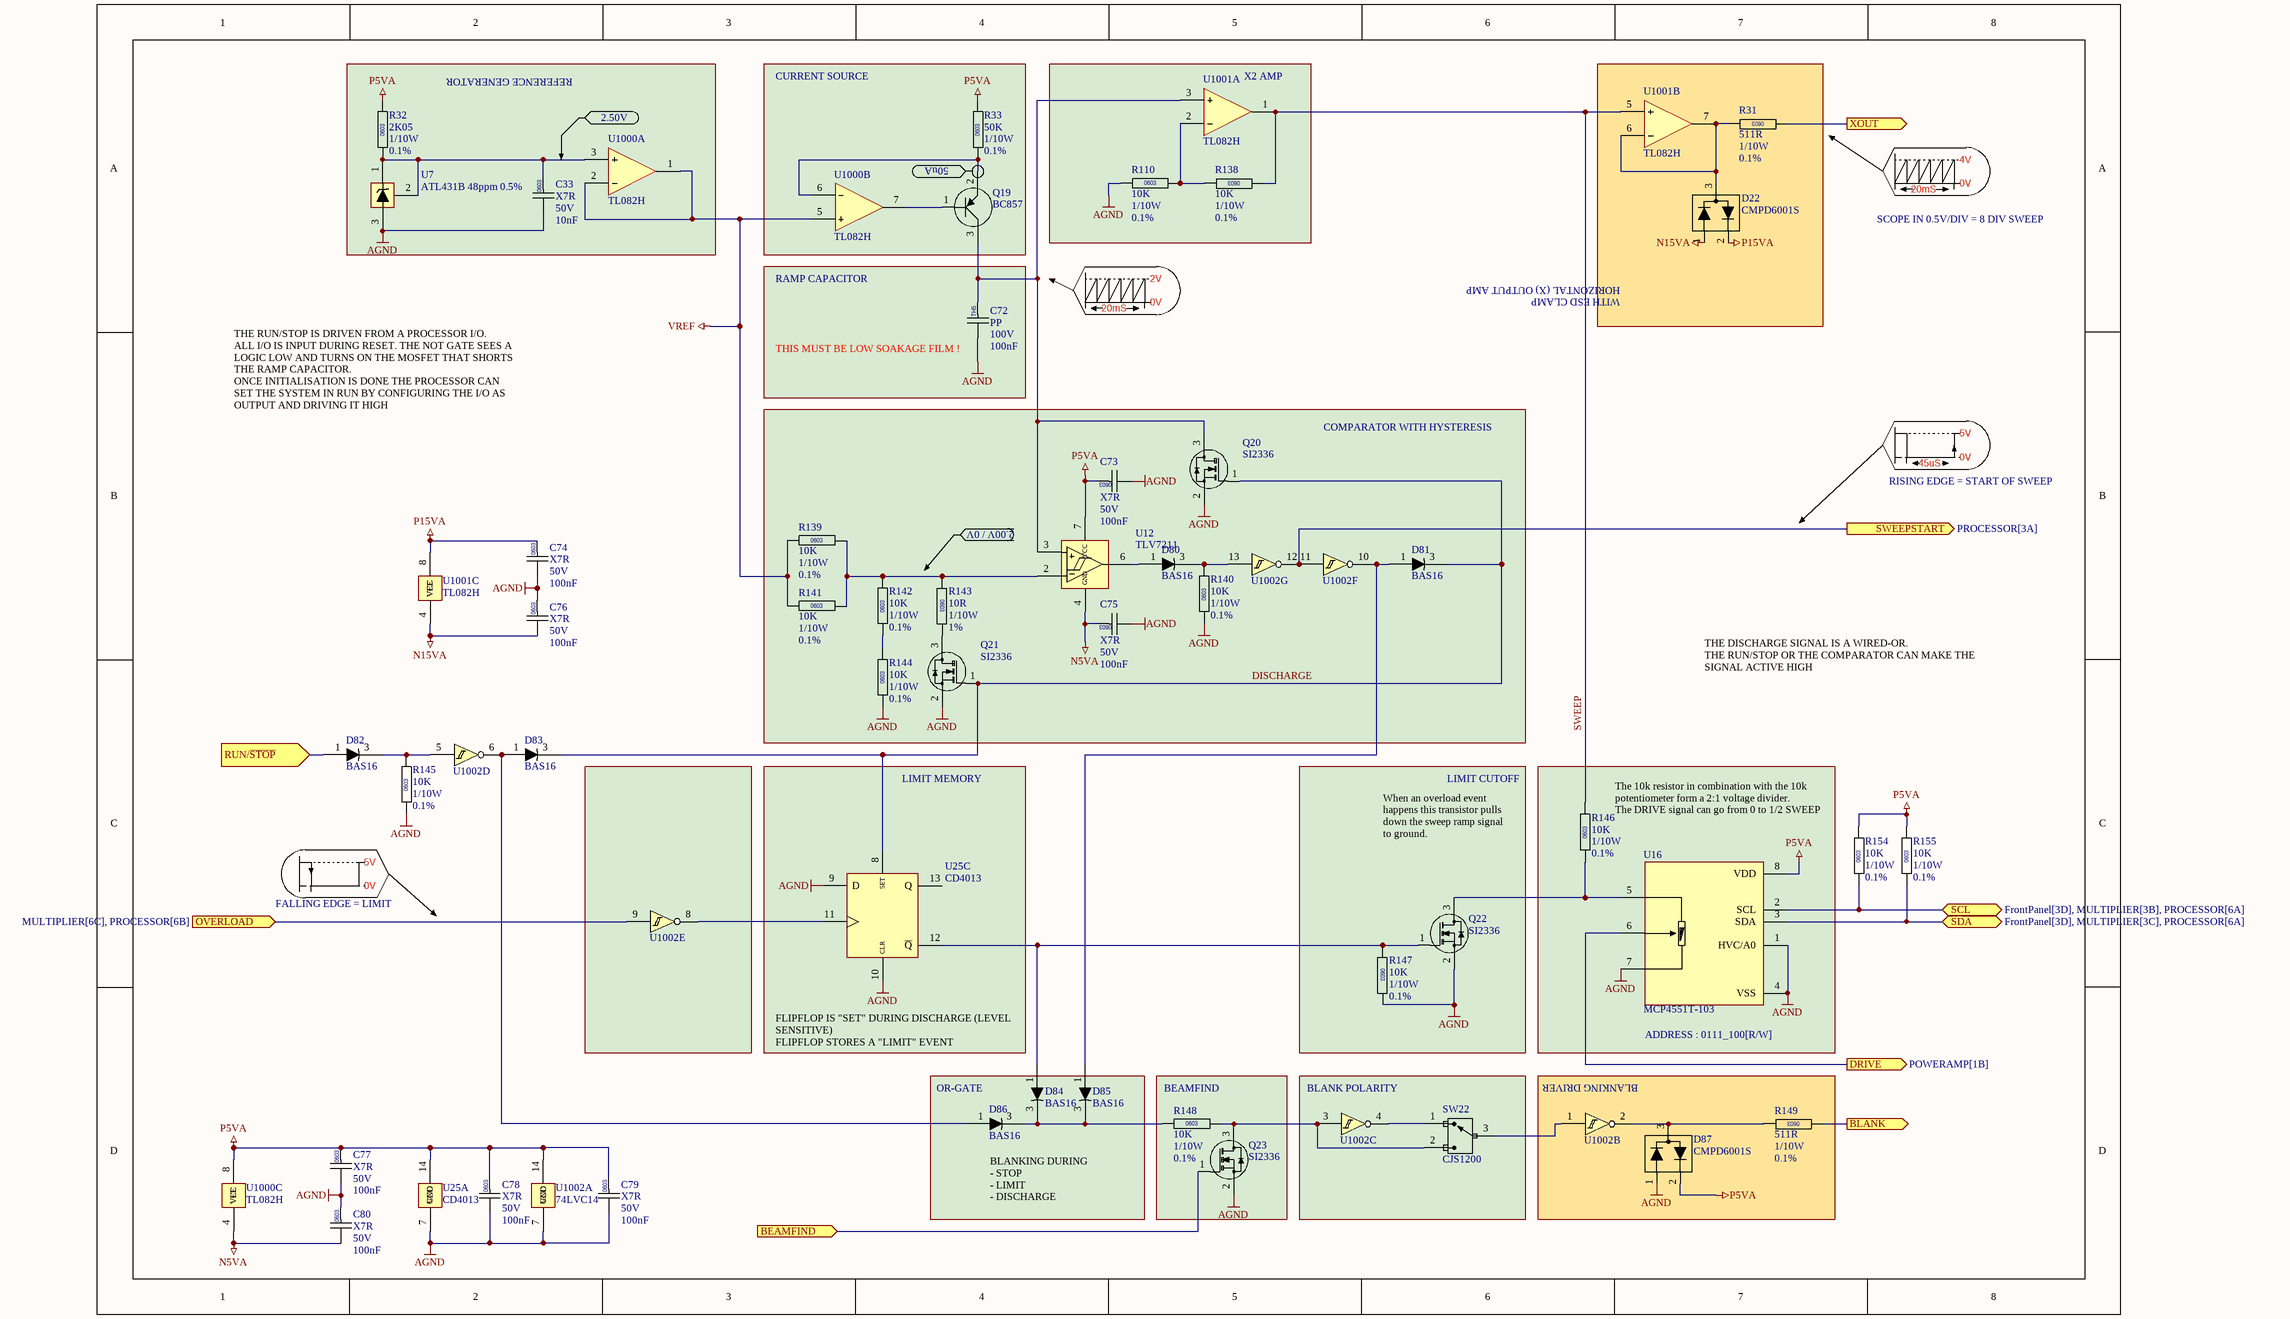
[diagram p4: SWEEP.SchDoc]

### Parts
C33  Dielectric: X7R  Voltage: 50V  Capacitance: 10nF  [CAPC0603]  (hidden comment: CAP0603)
C72  Dielectric: PP  Voltage: 100V  Capacitance: 100nF  [CAPF50P720X720]  (hidden comment: CAPF)
C73  Dielectric: X7R  Voltage: 50V  Capacitance: 100nF  [CAPC0603]  (hidden comment: CAP0603)
C74  Dielectric: X7R  Voltage: 50V  Capacitance: 100nF  [CAPC0603]  (hidden comment: CAP0603)
C75  Dielectric: X7R  Voltage: 50V  Capacitance: 100nF  [CAPC0603]  (hidden comment: CAP0603)
C76  Dielectric: X7R  Voltage: 50V  Capacitance: 100nF  [CAPC0603]  (hidden comment: CAP0603)
C77  Dielectric: X7R  Voltage: 50V  Capacitance: 100nF  [CAPC0603]  (hidden comment: CAP0603)
C78  Dielectric: X7R  Voltage: 50V  Capacitance: 100nF  [CAPC0603]  (hidden comment: CAP0603)
C79  Dielectric: X7R  Voltage: 50V  Capacitance: 100nF  [CAPC0603]  (hidden comment: CAP0603)
C80  Dielectric: X7R  Voltage: 50V  Capacitance: 100nF  [CAPC0603]  (hidden comment: CAP0603)
D22  CMPD6001S  [SOT23]
D80  BAS16  [SOT23]
D81  BAS16  [SOT23]
D82  BAS16  [SOT23]
D83  BAS16  [SOT23]
D84  BAS16  [SOT23]
D85  BAS16  [SOT23]
D86  BAS16  [SOT23]
D87  CMPD6001S  [SOT23]
Q19  BC857  [SOT23]
Q20  SI2336  [SOT23]
Q21  SI2336  [SOT23]
Q22  SI2336  [SOT23]
Q23  SI2336  [SOT23]
R31  value 511R  Power: 1/10W  Tolerance: 0.1%  [RESC0603]  (hidden comment: RESC0603)
R32  value 2K05  Power: 1/10W  Tolerance: 0.1%  [RESC0603]  (hidden comment: RESC0603)
R33  value 50K  Power: 1/10W  Tolerance: 0.1%  [RESC0603]  (hidden comment: RESC0603)
R110  value 10K  Power: 1/10W  Tolerance: 0.1%  [RESC0603]  (hidden comment: RESC0603)
R138  value 10K  Power: 1/10W  Tolerance: 0.1%  [RESC0603]  (hidden comment: RESC0603)
R139  value 10K  Power: 1/10W  Tolerance: 0.1%  [RESC0603]  (hidden comment: RESC0603)
R140  value 10K  Power: 1/10W  Tolerance: 0.1%  [RESC0603]  (hidden comment: RESC0603)
R141  value 10K  Power: 1/10W  Tolerance: 0.1%  [RESC0603]  (hidden comment: RESC0603)
R142  value 10K  Power: 1/10W  Tolerance: 0.1%  [RESC0603]  (hidden comment: RESC0603)
R143  value 10R  Power: 1/10W  Tolerance: 1%  [RESC0603]  (hidden comment: RESC0603)
R144  value 10K  Power: 1/10W  Tolerance: 0.1%  [RESC0603]  (hidden comment: RESC0603)
R145  value 10K  Power: 1/10W  Tolerance: 0.1%  [RESC0603]  (hidden comment: RESC0603)
R146  value 10K  Power: 1/10W  Tolerance: 0.1%  [RESC0603]  (hidden comment: RESC0603)
R147  value 10K  Power: 1/10W  Tolerance: 0.1%  [RESC0603]  (hidden comment: RESC0603)
R148  value 10K  Power: 1/10W  Tolerance: 0.1%  [RESC0603]  (hidden comment: RESC0603)
R149  value 511R  Power: 1/10W  Tolerance: 0.1%  [RESC0603]  (hidden comment: RESC0603)
R154  value 10K  Power: 1/10W  Tolerance: 0.1%  [RESC0603]  (hidden comment: RESC0603)
R155  value 10K  Power: 1/10W  Tolerance: 0.1%  [RESC0603]  (hidden comment: RESC0603)
SW22  CJS1200  [SWITCH-NIDEC-CJS-1200TB1]
U7  ATL431B 48ppm 0.5%  [SOT23]
U12  TLV7211  [SO127P600-8N]
U16  MCP4551T-103  [SO65P490-8N]
U25  CD4013  [SO127P600-14N]  (parts A,C of 3)
U1000  TL082H  [SO127P600-8N]  (parts A,B,C of 3)
U1001  TL082H  [SO127P600-8N]  (parts A,B,C of 3)
U1002  74LVC14  [SO127P600-14N]  (parts A,B,C,D,E,F,G of 7)

### Blocks framed on the sheet
X2 AMP: R110 R138 U1001
LIMIT MEMORY: U25
LIMIT CUTOFF: Q22 R147
ADDRESS : 0111_100[R/W]: R146 U16
OR-GATE: D84-D86
BEAMFIND: Q23 R148
BLANK POLARITY: SW22 U1002
BLANKING DRIVER: D87 R149 U1002

### Ports
BEAMFIND (in), BLANK (out), DRIVE (out, see POWERAMP[1B]), OVERLOAD (in, see MULTIPLIER[6C], PROCESSOR[6B]), RUN/~{STOP} (in), SCL (bidir, see FrontPanel[3D], MULTIPLIER[3B], PROCESSOR[6A]), SDA (bidir, see FrontPanel[3D], MULTIPLIER[3C], PROCESSOR[6A]), SWEEPSTART (out, see PROCESSOR[3A]), XOUT (out)

### Nets
AGND: C33.2 C72.2 C73.2 C74.2 C75.2 C76.1 C77.2 C78.2 C79.2 C80.1 D87.1(K) Q20.2(S) Q21.2(S) Q22.2(S) Q23.2(S) R110.2 R140.2 R144.2 R145.2 R147.1 U7.3 U16.1(HVC/A0) U16.4(VSS) U16.7(POB) U25.7(GND) U25.9(D) U25.10(CLR) U1002.7(GND)
N5VA: C75.1 C80.2 U12.4(GND) U1000.4(VEE)
N15VA: C76.2 D22.1(K) U1001.4(VEE)
P5VA: C73.1 C77.1 C78.1 C79.1 D87.2(A) R32.1 R33.1 R154.1 R155.1 U12.7(VCC) U16.8(VDD) U25.14(VCC) U1000.8(VCC) U1002.14(VCC)
P15VA: C74.1 D22.2(A) U1001.8(VCC)
VREF: R139.2 R141.2 U1000.1(O) U1000.2(-) U1000.5(+)
BEAMFIND: Q23.1(G1) ; port BEAMFIND
BLANK: R149.2 ; port BLANK
DISCHARGE: D81.3(K) D83.3(K) Q20.1(G1) Q21.1(G1) U25.8(SET)
DRIVE: U16.6(OW) ; port DRIVE
OVERLOAD: U1002.9 ; port OVERLOAD
RUN/~{STOP}: D82.1(A) ; port RUN/~{STOP}
SCL: R154.2 U16.2(SCL) ; port SCL
SDA: R155.2 U16.3(SDA) ; port SDA
SWEEP: R138.2 R146.1 U1001.1(O) U1001.5(+)
SWEEPSTART: U1002.11 U1002.12 ; port SWEEPSTART
XOUT: R31.2 ; port XOUT
NetC33_1: C33.1 R32.2 U7.1 U7.2 U1000.3(+)
NetC72_1: C72.1 Q19.3(C) Q20.3(D) U12.3(+) U1001.3(+)
NetD22_3: D22.3(A) R31.1 U1001.6(-) U1001.7(O)
NetD80_1: D80.1(A) U12.6(OUT)
NetD80_3: D80.3(K) R140.1 U1002.13
NetD81_1: D81.1(A) D85.1(A) U1002.10
NetD82_3: D82.3(K) R145.1 U1002.5
NetD83_1: D83.1(A) D86.1(A) U1002.6
NetD84_1: D84.1(A) Q22.1(G1) R147.2 U25.12(~{Q})
NetD84_3: D84.3(K) D85.3(K) D86.3(K) R148.2
NetD87_3: D87.3(A) R149.1 U1002.2
NetQ19_1: Q19.1(B) U1000.7(O)
NetQ19_2: Q19.2(E) R33.2 U1000.6(-)
NetQ21_3: Q21.3(D) R143.1
NetQ22_3: Q22.3(D) R146.2 U16.5(POA)
NetQ23_3: Q23.3(D) R148.1 SW22.2 U1002.3
NetR110_1: R110.1 R138.1 U1001.2(-)
NetR139_1: R139.1 R141.1 R142.1 R143.2 U12.2(-)
NetR142_2: R142.2 R144.1
NetSW22_1: SW22.1 U1002.4
NetSW22_3: SW22.3 U1002.1
NetU25_11: U25.11(CLK) U1002.8

Not connected (* = marked no-connect by the designer): U25 13(Q)

### Notes on the sheet
- REFERENCE GENERATOR
- CURRENT SOURCE
- (near U1000) 2.50V
- (near Q19) 50uA
- 20mS
- 4V
- 0V
- SCOPE IN 0.5V/DIV = 8 DIV SWEEP
- RAMP CAPACITOR
- 2V
- HORIZONTAL (X) OUTPUT AMP
- WITH ESD CLAMP
- (near C72) THIS MUST BE LOW SOAKAGE FILM !
- THE RUN/STOP IS DRIVEN FROM A PROCESSOR I/O.
  ALL I/O IS INPUT DURING RESET. THE NOT GATE SEES A LOGIC LOW AND TURNS ON THE MOSFET THAT SHORTS THE RAMP CAPACITOR.
  ONCE INITIALISATION IS DONE THE PROCESSOR CAN SET THE SYSTEM IN RUN BY CONFIGURING THE I/O AS OUTPUT AND DRIVING IT HIGH
- COMPARATOR WITH HYSTERESIS
- 5V
- RISING EDGE = START OF SWEEP
- 45uS
- 2.00V / 0V
- THE DISCHARGE SIGNAL IS A WIRED-OR.
  THE RUN/STOP OR THE COMPARATOR CAN MAKE THE SIGNAL ACTIVE HIGH
- (near U16) The 10k resistor in combination with the 10k potentiometer form a 2:1 voltage divider.
  The DRIVE signal can go from 0 to 1/2 SWEEP
- FALLING EDGE = LIMIT
- When an overload event happens this transistor pulls down the sweep ramp signal to ground.
- FLIPFLOP IS "SET" DURING DISCHARGE (LEVEL SENSITIVE)
  FLIPFLOP STORES A "LIMIT" EVENT
- (near D86) BLANKING DURING
  - STOP
  - LIMIT
  - DISCHARGE
- (in symbol CAPF-100nF-100V) TH5
- (in symbol RESC-0603-2K05-0.1%-1/10W) 0603
- (in symbol RESC-0603-10K-0.1%-1/10W) 0603
- (in symbol RESC-0603-10R-1%-1/10W) 0603
- (in symbol RESC-0603-50K-0.1%-1/10W) 0603
- (in symbol RESC-0603-511R-0.1%) 0603

### Library data of the parts
C33 = CAPC-0603-10nF-50V-X7R: CAPACITOR,CERAMIC,10nF,50V,X7R,0603; Package / Case: 0603; Location: *
C72 = CAPF-100nF-100V: CAPACITOR,POLYPROP,100nF,100V; Manufacturer 1: KEMET; Manufacturer Part Number 1: PHE426DJ6100JR05; Package / Case: CAPF50P720X720; Location: *; DIGIKEY: 399-11462-ND
C73-C80 = CAPC-0603-100nF-50V-X7R: as C68 on sheet POWERAMP; Package / Case: 0603; Location: *; Supplier 1: Mouser; Supplier Part Number 1: 80-C0603C104K5R7867; Supplier 2: Mouser; Supplier Part Number 2: 80-C0603C104K5R7411; Supplier 3: Avnet; Supplier Part Number 3: KGM15BR71H104KT; Supplier 4: Digikey; Supplier Part Number 4: 1276-1000-1-ND; LCSC: C127833; MOUSER: 80-C0603C104K5R
D22 D87 = DIODE-CENTRALSEMI-CMPD6001S: as D23 on sheet IBVG-DRIVER; DIGIKEY: 1514-CMPD6001STRPBFREECT-ND; Manufacturer Part Number 1: CMPD6001S
D80-D86 = DIODE-RECTIFIER-DIODES-BAS16-SOT23: as D41 on sheet PSU; DIGIKEY: BAS16LT1GOSCT-ND
Q19 = XSTR-PNP-BC857: as Q3 on sheet IBVG-DRIVER; DIGIKEY: 1727-4869-1-ND
Q20-Q23 = XSTR-NMOS-VISHAY-SI2336DS-T1-BE3: as Q15 on sheet PSU; Package: SOT23; Vds: 30V; Idmax: 4.3A; DIGIKEY: 742-SI2336DS-T1-BE3CT-ND; Manufacturer Part Number 1: SI2336DS-T1-BE3
R31 R149 = RESC-0603-511R-0.1%: RESISTOR,511R,0.1%,100mW,0603 (1608); Location: *
R32 = RESC-0603-2K05-0.1%-1/10W: RESISTOR,2K05,0.11%,100mW,0603 (1608); Location: *
R33 = RESC-0603-50K-0.1%-1/10W: RESISTOR,50K,0.1%,100mW,0603 (1608); Location: *
R110 R138-R142 R144-R148 R154 R155 = RESC-0603-10K-0.1%-1/10W: as R101 on sheet POWERAMP; Location: *; DIGIKEY: P10KDBCT-ND
R143 = RESC-0603-10R-1%-1/10W: RESISTOR,10R,1%,100mW,0603 (1608); Location: *
SW22 = SWITCH-NIDEC-CJS-1200TB1: SWITCH,SPST,SLIDE,SMD; Manufacturer 1: NIDEC; DIGIKEY: 563-CJS-1200TB1CT-ND; Manufacturer Part Number 1: CJS-1200TB1
U7 = IC-TI-ATL431B-SOT23: as U9 on sheet IBVG-DRIVER; DIGIKEY: 296-47739-1-ND
U12 = IC-TI-TLV7211-SO8: IC,COMPARATOR,SINGLE,PUSHPULL,TI,TLV7211,SO8; Manufacturer Part Number 1: TLV7211IDR; DIGIKEY: 296-21871-1-ND; Manufacturer 1: TI
U16 = IC-MICROCHIP-MCP4551T-103: IC,DIGITAL POTMETER,257STEP,I2C,10K,MICROCHIP,MCP4551T-103; Manufacturer Part Number 1: MCP4551T-103E/MS; DIGIKEY: MCP4551T-103E/MSCT-ND; Manufacturer 1: MICROCHIP
U25 = IC-TI-CD4013-SO14: IC,LOGIC,CMOS,4XXX,DUAL D-FLIPFLOP,CD4013; Manufacturer 1: TI; Manufacturer Part Number 1: CD4013BM96; DIGIKEY: 296-24347-1-ND
U1000 U1001 = IC-TI-TL082H-SO8: as U30 on sheet POWERAMP; Manufacturer Part Number 1: TL082HIDR; MOUSER: 595-TL082HIDR
U1002 = IC-DIODES-74LVC14AS14-13-SO14: IC,LOGIC,CMOS,74XX,HEX SCHMITTTRIGGER,74LVC14AS14-13,SO14; Manufacturer 1: DIODES; DIGIKEY: 74LVC14AS14-13DICT-ND; Manufacturer Part Number 1: 74LVC14AS14-13